# Altium project roverSwitch.PrjPcb (part 1 of 2)
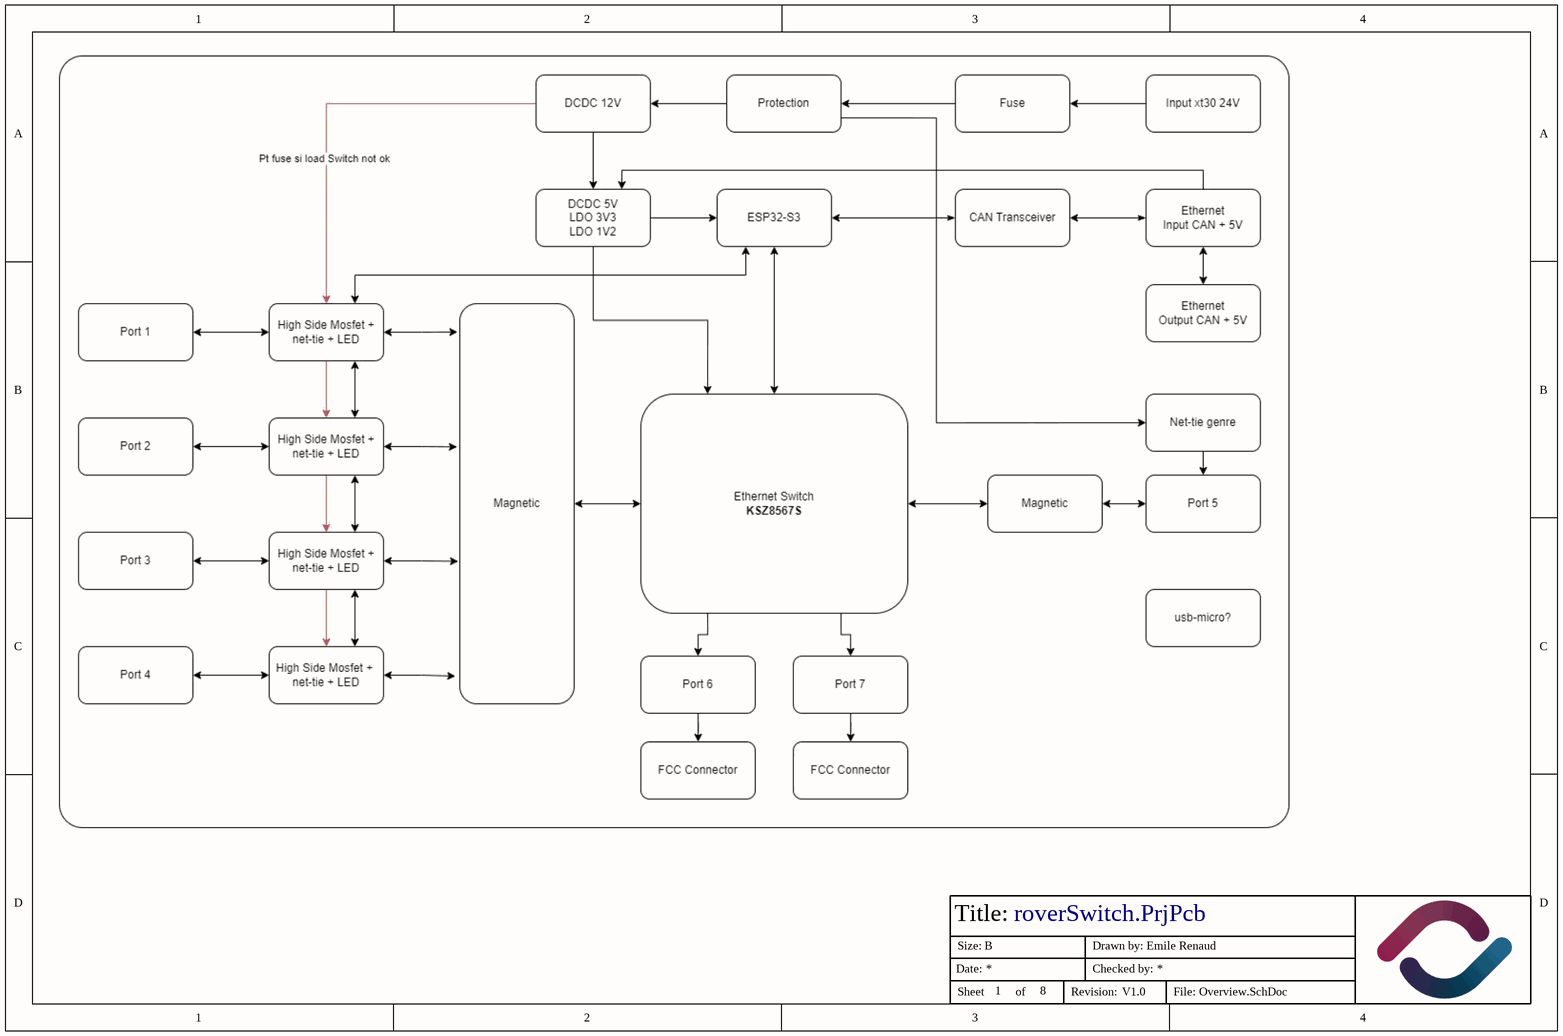
[diagram p0: Overview.SchDoc]
8 sheets, 263 parts. Net scope: flat (ports and power ports of the same name join across sheets).
Board file: roverSwitch.PcbDoc
Sheets:
  Overview.SchDoc
  Connectors_2.SchDoc
  KSZ_Switch.SchDoc
  KSZ_Switch_Control.SchDoc
  Connectors_1.SchDoc
  ESP32.SchDoc
  Power.SchDoc
  CAN-SW.SchDoc

## Sheet Overview.SchDoc
size A4; DrawnBy: Emile Renaud; Revision: V1.0; SheetNumber: 1; SheetTotal: 8

### Notes on the sheet
- Title:
- Date:
- Size:
- B
- Drawn by:
- Checked by:
- Sheet
- of
- Revision:
- File:

## Sheet Connectors_2.SchDoc
size A4; DrawnBy: Emile Renaud; Revision: V1.0; SheetNumber: 8; SheetTotal: 8
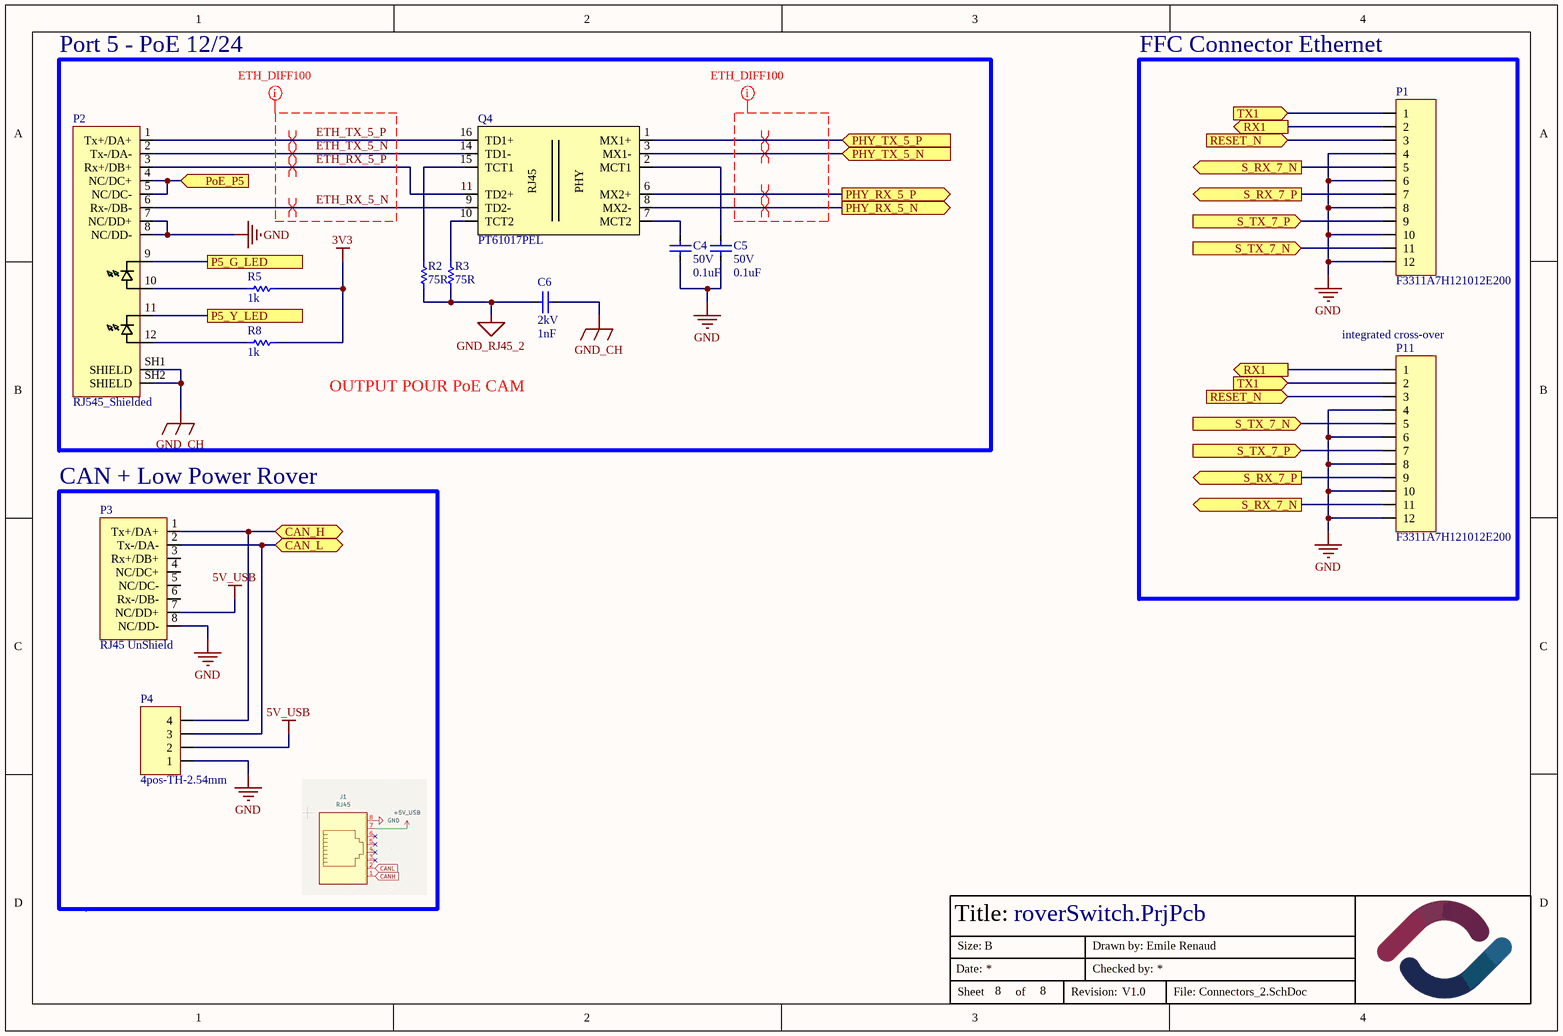
[diagram p1: Connectors_2.SchDoc]

### Parts
C4  value 0.1uF  Volt: 50V  [CAPACITOR-0603]  (hidden comment: Capacitor-0603-0.1uF-50V-X7R)
C5  value 0.1uF  Volt: 50V  [CAPACITOR-0603]  (hidden comment: Capacitor-0603-0.1uF-50V-X7R)
C6  value 1nF  Volt: 2kV  [CAPACITOR-1206]  (hidden comment: Capacitor-1206-1nF-2kV-X7R)
P1  F3311A7H121012E200  [AMPHENOL_F3311A7H121012E200]
P2  RJ545_Shielded  [ADAMTECH_MTJ-88ARX1-FSM-LG]
P3  RJ45 UnShield  [AMPHENOL_54602-908LF]
P4  4pos-TH-2.54mm  [HDR1X4]
P11  F3311A7H121012E200  [AMPHENOL_F3311A7H121012E200]
Q4  PT61017PEL  [SOIC_PT61017PEL]
R2  value 75R  [Resistor-0603]  (hidden comment: SMT resistor)
R3  value 75R  [Resistor-0603]  (hidden comment: SMT resistor)
R5  value 1k  [Resistor-0603]  (hidden comment: SMT resistor)
R8  value 1k  [Resistor-0603]  (hidden comment: SMT resistor)

### Blocks framed on the sheet
Port 5 - PoE 12/24: C4-C6 P2 Q4 R2 R3 R5 R8
FFC Connector Ethernet: P1 P11
CAN + Low Power Rover: P3 P4

### Ports
CAN_H (bidir), CAN_L (bidir), P5_G_LED, P5_Y_LED, PHY_RX_5_N (out), PHY_RX_5_P (out), PHY_TX_5_N (in), PHY_TX_5_P (in), PoE_P5 (in), RESET_N (in), RX1 (out), S_RX_7_N (out), S_RX_7_P (out), S_TX_7_N (in), S_TX_7_P (in), TX1 (in)

### Nets
3V3: R5.1 R8.1
5V_USB: P3.7(NC/DD+) P4.2
GND: C4.1 C5.1 P1.4 P1.6 P1.8 P1.10 P1.12 P2.7(NC/DD+) P2.8(NC/DD-) P3.8(NC/DD-) P4.1 P11.4 P11.6 P11.8 P11.10 P11.12
GND_CH: C6.2 P2.SH1(SHIELD) P2.SH2(SHIELD)
GND_RJ45_2: C6.1 R2.1 R3.1
CAN_H: P3.1(Tx+/DA+) P4.4 ; port CAN_H
CAN_L: P3.2(Tx-/DA-) P4.3 ; port CAN_L
ETH_RX_5_N: P2.6(Rx-/DB-) Q4.9(TD2-)
ETH_RX_5_P: P2.3(Rx+/DB+) Q4.11(TD2+)
ETH_TX_5_N: P2.2(Tx-/DA-) Q4.14(TD1-)
ETH_TX_5_P: P2.1(Tx+/DA+) Q4.16(TD1+)
P5_G_LED: P2.9 ; port P5_G_LED
P5_Y_LED: P2.11 ; port P5_Y_LED
PHY_RX_5_N: Q4.8(MX2-) ; port PHY_RX_5_N
PHY_RX_5_P: Q4.6(MX2+) ; port PHY_RX_5_P
PHY_TX_5_N: Q4.3(MX1-) ; port PHY_TX_5_N
PHY_TX_5_P: Q4.1(MX1+) ; port PHY_TX_5_P
PoE_P5: P2.4(NC/DC+) P2.5(NC/DC-) ; port PoE_P5
RESET_N: P1.3 P11.3 ; port RESET_N
RX1: P1.2 P11.1 ; port RX1
S_RX_7_N: P1.5 P11.11 ; port S_RX_7_N
S_RX_7_P: P1.7 P11.9 ; port S_RX_7_P
S_TX_7_N: P1.11 P11.5 ; port S_TX_7_N
S_TX_7_P: P1.9 P11.7 ; port S_TX_7_P
TX1: P1.1 P11.2 ; port TX1
NetC4_2: C4.2 Q4.7(MCT2)
NetC5_2: C5.2 Q4.2(MCT1)
NetP2_10: P2.10 R5.2
NetP2_12: P2.12 R8.2
NetQ4_10: Q4.10(TCT2) R3.2
NetQ4_15: Q4.15(TCT1) R2.2

Not connected (* = marked no-connect by the designer): P3 3(Rx+/DB+) 4(NC/DC+) 5(NC/DC-) 6(Rx-/DB-)

### Layout directives
net class MDI_DIFF100: (no net found under the mark), ETH_RX_5_N, ETH_RX_5_P, ETH_TX_5_N, ETH_TX_5_P
differential pair: ETH_RX_5_N, ETH_RX_5_P, ETH_TX_5_N, ETH_TX_5_P, PHY_RX_5_N, PHY_RX_5_P, PHY_TX_5_N, PHY_TX_5_P

### Notes on the sheet
- (near P11) integrated cross-over
- OUTPUT POUR PoE CAM
- Title:
- Date:
- Size:
- B
- Drawn by:
- Checked by:
- Sheet
- of
- Revision:
- File:
- (in symbol PT61017PEL) RJ45; PHY

### Library data of the parts
C4 C5 = Capacitor-0603-0.1uF-50V-X7R: Precision: X7R-10%; Package / Case: Metric 1608, EIA 0603; Mounted: Yes; Supplier 1: Digi-Key; Supplier Part Number 1: 1276-1935-2-ND; Supplier 2: Digi-Key; Supplier Part Number 2: 1276-1934-2-ND
C6 = Capacitor-1206-1nF-2kV-X7R: Precision: X7R-10%; Package / Case: Metric 3216, EIA 1206; Mounted: Yes; Supplier 1: Digi-Key; Supplier Part Number 1: 399-C1206C102KGRAC7800CT-ND; Supplier 2: Digi-Key
P1 P11 = FFC-12P-0.5MM-R/A: CONN FFC FPC 12POS 0.5MM R/A; Volt: 50V; Supplier 1: Digi-Key; Supplier Part Number 1: 609-F3311A7H121012E200CT-ND; Mounted: Yes; Package / Case: SMD
P2 = RJ545_Shielded: Jack Modular Connector 8p8c (RJ45, Ethernet) 90° Angle (Right) Shielded with LEDs; Supplier 1: Digikey; Supplier Part Number 1: 2057-MTJ-88ARX1-FSM-LG-ND; Mounted: Yes; Package / Case: SMD; Volt: N/A; HelpURL: https://app.adam-tech.com/products/download/data_sheet/203879/mtj-88arx1-fsm-lg-data-sheet.pdf
P3 = RJ545: Jack Modular Connector 8p8c (RJ45, Ethernet) 90° Angle (Right) Unshielded Cat3; Supplier 1: Digikey; Supplier Part Number 1: 609-1046-ND; Mounted: Yes; Package / Case: SMD; Volt: N/A; HelpURL: https://cdn.amphenol-cs.com/media/wysiwyg/files/drawing/c-bmj-0102.pdf
P4 = 4pos-TH-2.54mm: 4pos TH 2.54mm Header; Supplier 1: Digi-Key; Supplier Part Number 1: N/A; Mounted: Yes; Package / Case: TH; Volt: N/A
Q4 = PT61017PEL: 350µH LAN 10/100 Base-T Pulse Transformer 1CT:1CT Surface Mount; Supplier 1: Digi-Key; Supplier Part Number 1: PT61017PELCT-ND; Mounted: Yes
R2 R3 = Resistor-0603-75R: Resistor0603-75R; Precision: 1%; Watt: 0.1W; Mounted: Yes; Package / Case: Metric 1608, EIA 0603; Supplier 1: Digi-Key; Supplier Part Number 1: 311-75.0HRCT-ND
R5 R8 = Resistor-0603-1k: Resistor0603-1k; Precision: 1%; Watt: 0.1W; Mounted: Yes; Package / Case: Metric 1608, EIA 0603; Supplier 1: Digi-Key; Supplier Part Number 1: 311-1.00KHRCT-ND

## Sheet KSZ_Switch.SchDoc
size A4; DrawnBy: Emile Renaud; Revision: V1.0; SheetNumber: 5; SheetTotal: 8
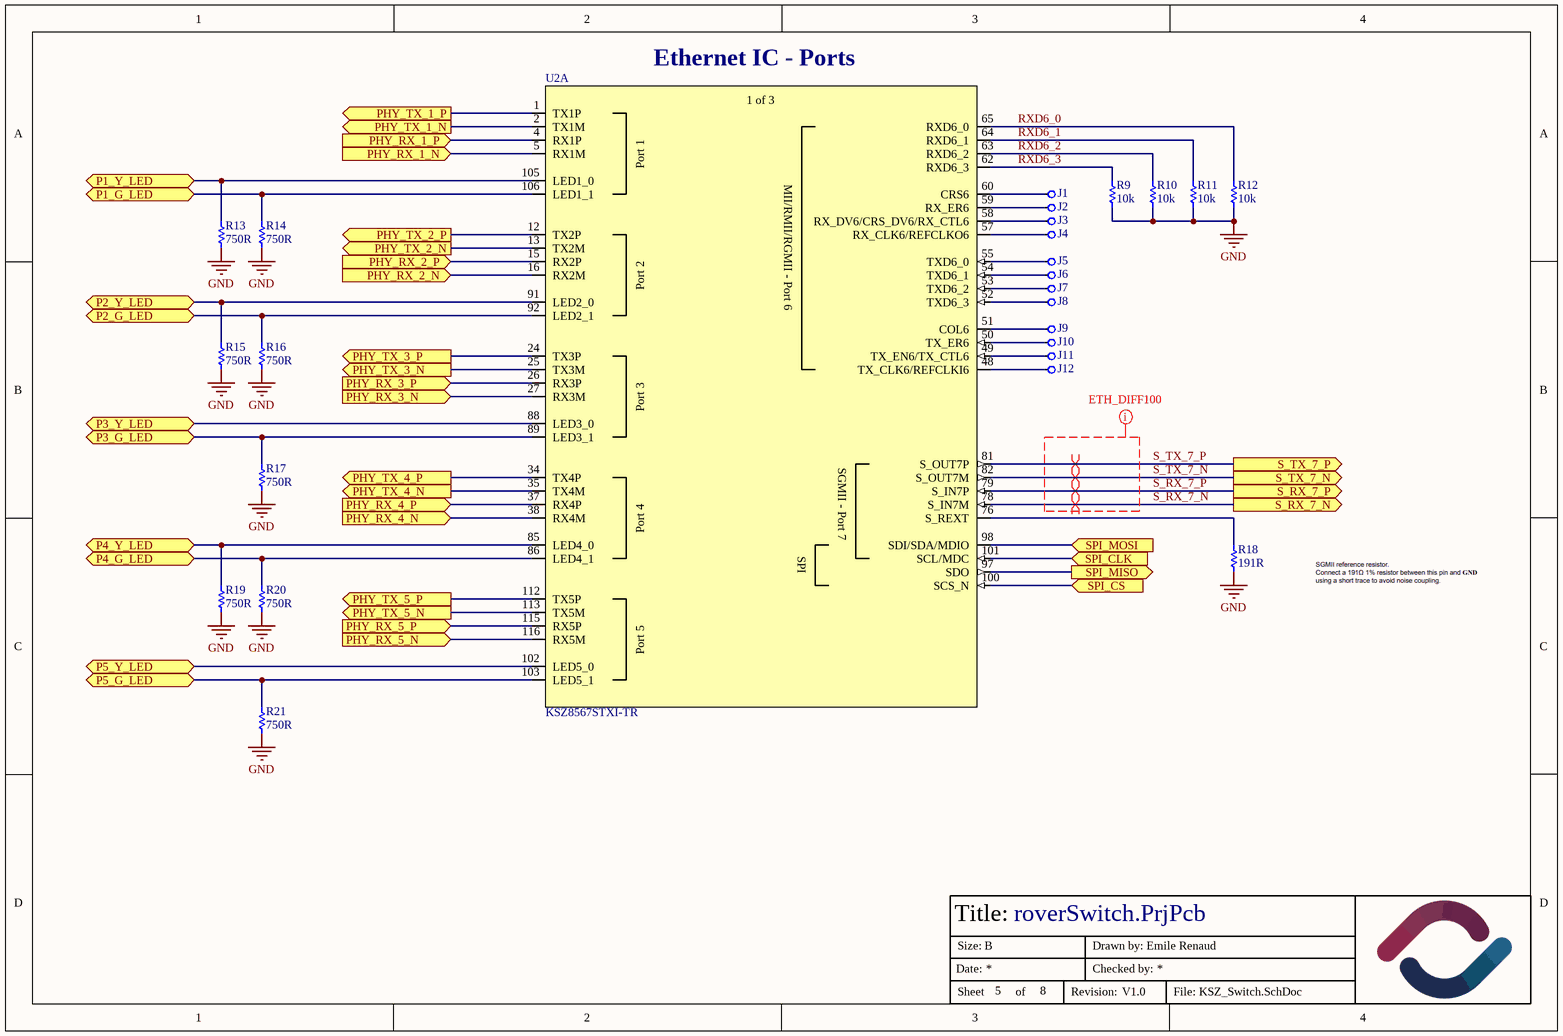
[diagram p2: KSZ_Switch.SchDoc]

### Parts
J1  hole  [PAD-0.53MM]  (value not drawn)  (no BOM)
J2  hole  [PAD-0.53MM]  (value not drawn)  (no BOM)
J3  hole  [PAD-0.53MM]  (value not drawn)  (no BOM)
J4  hole  [PAD-0.53MM]  (value not drawn)  (no BOM)
J5  hole  [PAD-0.53MM]  (value not drawn)  (no BOM)
J6  hole  [PAD-0.53MM]  (value not drawn)  (no BOM)
J7  hole  [PAD-0.53MM]  (value not drawn)  (no BOM)
J8  hole  [PAD-0.53MM]  (value not drawn)  (no BOM)
J9  hole  [PAD-0.53MM]  (value not drawn)  (no BOM)
J10  hole  [PAD-0.53MM]  (value not drawn)  (no BOM)
J11  hole  [PAD-0.53MM]  (value not drawn)  (no BOM)
J12  hole  [PAD-0.53MM]  (value not drawn)  (no BOM)
R9  value 10k  [Resistor-0603]  (hidden comment: SMT resistor)
R10  value 10k  [Resistor-0603]  (hidden comment: SMT resistor)
R11  value 10k  [Resistor-0603]  (hidden comment: SMT resistor)
R12  value 10k  [Resistor-0603]  (hidden comment: SMT resistor)
R13  value 750R  [Resistor-0603]  (hidden comment: SMT resistor)
R14  value 750R  [Resistor-0603]  (hidden comment: SMT resistor)
R15  value 750R  [Resistor-0603]  (hidden comment: SMT resistor)
R16  value 750R  [Resistor-0603]  (hidden comment: SMT resistor)
R17  value 750R  [Resistor-0603]  (hidden comment: SMT resistor)
R18  value 191R  [Resistor-0603]  (hidden comment: SMT resistor)
R19  value 750R  [Resistor-0603]  (hidden comment: SMT resistor)
R20  value 750R  [Resistor-0603]  (hidden comment: SMT resistor)
R21  value 750R  [Resistor-0603]  (hidden comment: SMT resistor)
U2  KSZ8567STXI-TR  [TQFP128_EP_6XX_MCH-M]  (part A of 3)

### Ports
P1_G_LED (bidir), P1_Y_LED (bidir), P2_G_LED (bidir), P2_Y_LED (bidir), P3_G_LED (bidir), P3_Y_LED (bidir), P4_G_LED (bidir), P4_Y_LED (bidir), P5_G_LED (bidir), P5_Y_LED (bidir), PHY_RX_1_N (in), PHY_RX_1_P (in), PHY_RX_2_N (in), PHY_RX_2_P (in), PHY_RX_3_N (in), PHY_RX_3_P (in), PHY_RX_4_N (in), PHY_RX_4_P (in), PHY_RX_5_N (in), PHY_RX_5_P (in), PHY_TX_1_N (out), PHY_TX_1_P (out), PHY_TX_2_N (out), PHY_TX_2_P (out), PHY_TX_3_N (out), PHY_TX_3_P (out), PHY_TX_4_N (out), PHY_TX_4_P (out), PHY_TX_5_N (out), PHY_TX_5_P (out), S_RX_7_N (out), S_RX_7_P (out), S_TX_7_N (out), S_TX_7_P (out), SPI_CLK (in), SPI_CS (in), SPI_MISO (out), SPI_MOSI (in)

### Nets
GND: R9.1 R10.1 R11.1 R12.1 R13.1 R14.1 R15.1 R16.1 R17.1 R18.1 R19.1 R20.1 R21.1
P1_G_LED: R14.2 U2.106(LED1_1) ; port P1_G_LED
P1_Y_LED: R13.2 U2.105(LED1_0) ; port P1_Y_LED
P2_G_LED: R16.2 U2.92(LED2_1) ; port P2_G_LED
P2_Y_LED: R15.2 U2.91(LED2_0) ; port P2_Y_LED
P3_G_LED: R17.2 U2.89(LED3_1) ; port P3_G_LED
P3_Y_LED: U2.88(LED3_0) ; port P3_Y_LED
P4_G_LED: R20.2 U2.86(LED4_1) ; port P4_G_LED
P4_Y_LED: R19.2 U2.85(LED4_0) ; port P4_Y_LED
P5_G_LED: R21.2 U2.103(LED5_1) ; port P5_G_LED
P5_Y_LED: U2.102(LED5_0) ; port P5_Y_LED
PHY_RX_1_N: U2.5(RX1M) ; port PHY_RX_1_N
PHY_RX_1_P: U2.4(RX1P) ; port PHY_RX_1_P
PHY_RX_2_N: U2.16(RX2M) ; port PHY_RX_2_N
PHY_RX_2_P: U2.15(RX2P) ; port PHY_RX_2_P
PHY_RX_3_N: U2.27(RX3M) ; port PHY_RX_3_N
PHY_RX_3_P: U2.26(RX3P) ; port PHY_RX_3_P
PHY_RX_4_N: U2.38(RX4M) ; port PHY_RX_4_N
PHY_RX_4_P: U2.37(RX4P) ; port PHY_RX_4_P
PHY_RX_5_N: U2.116(RX5M) ; port PHY_RX_5_N
PHY_RX_5_P: U2.115(RX5P) ; port PHY_RX_5_P
PHY_TX_1_N: U2.2(TX1M) ; port PHY_TX_1_N
PHY_TX_1_P: U2.1(TX1P) ; port PHY_TX_1_P
PHY_TX_2_N: U2.13(TX2M) ; port PHY_TX_2_N
PHY_TX_2_P: U2.12(TX2P) ; port PHY_TX_2_P
PHY_TX_3_N: U2.25(TX3M) ; port PHY_TX_3_N
PHY_TX_3_P: U2.24(TX3P) ; port PHY_TX_3_P
PHY_TX_4_N: U2.35(TX4M) ; port PHY_TX_4_N
PHY_TX_4_P: U2.34(TX4P) ; port PHY_TX_4_P
PHY_TX_5_N: U2.113(TX5M) ; port PHY_TX_5_N
PHY_TX_5_P: U2.112(TX5P) ; port PHY_TX_5_P
RXD6_0: R12.2 U2.65(RXD6_0)
RXD6_1: R11.2 U2.64(RXD6_1)
RXD6_2: R10.2 U2.63(RXD6_2)
RXD6_3: R9.2 U2.62(RXD6_3)
S_RX_7_N: U2.78(S_IN7M) ; port S_RX_7_N
S_RX_7_P: U2.79(S_IN7P) ; port S_RX_7_P
S_TX_7_N: U2.82(S_OUT7M) ; port S_TX_7_N
S_TX_7_P: U2.81(S_OUT7P) ; port S_TX_7_P
SPI_CLK: U2.101(SCL/MDC) ; port SPI_CLK
SPI_CS: U2.100(SCS_N) ; port SPI_CS
SPI_MISO: U2.97(SDO) ; port SPI_MISO
SPI_MOSI: U2.98(SDI/SDA/MDIO) ; port SPI_MOSI
NetJ1_1: J1.1 U2.60(CRS6)
NetJ2_1: J2.1 U2.59(RX_ER6)
NetJ3_1: J3.1 U2.58(RX_DV6/CRS_DV6/RX_CTL6)
NetJ4_1: J4.1 U2.57(RX_CLK6/REFCLKO6)
NetJ5_1: J5.1 U2.55(TXD6_0)
NetJ6_1: J6.1 U2.54(TXD6_1)
NetJ7_1: J7.1 U2.53(TXD6_2)
NetJ8_1: J8.1 U2.52(TXD6_3)
NetJ9_1: J9.1 U2.51(COL6)
NetJ10_1: J10.1 U2.50(TX_ER6)
NetJ11_1: J11.1 U2.49(TX_EN6/TX_CTL6)
NetJ12_1: J12.1 U2.48(TX_CLK6/REFCLKI6)
NetR18_2: R18.2 U2.76(S_REXT)

### Layout directives
differential pair: S_RX_7_N, S_RX_7_P, S_TX_7_N, S_TX_7_P
net class MDI_DIFF100: (no net found under the mark)

### Notes on the sheet
- (near U2) Ethernet IC - Ports
- Title:
- Date:
- Size:
- B
- Drawn by:
- Checked by:
- Sheet
- of
- Revision:
- File:
- (in symbol KSZ8567STXI-TR, part A) 1 of 3; Port 1; MII/RMII/RGMII - Port 6; Port 2; Port 3; SGMII - Port 7; Port 4; SPI; Port 5

### Library data of the parts
J1-J12 = PAD 0.53mm AWG28-Solid: PAD for 28 AWG Solid Wire; Mounted: N/A
R9-R12 = Resistor-0603-10k: Resistor0603-10k; Precision: 1%; Watt: 0.1W; Mounted: Yes; Package / Case: Metric 1608, EIA 0603; Supplier 1: Digi-Key; Supplier Part Number 1: 311-10.0KHRTR-ND
R13-R17 R19-R21 = Resistor-0603-750R: Resistor0603-750R; Precision: 1%; Watt: 0.1W; Mounted: Yes; Package / Case: Metric 1608, EIA 0603; Supplier 1: Digi-Key; Supplier Part Number 1: 311-750HRCT-ND
R18 = Resistor-0603-191R: Precision: 1%; Watt: 0.1W; Mounted: Yes; Package / Case: Metric 1608, EIA 0603; Supplier 1: Digi-Key; Supplier Part Number 1: 311-191HRCT-ND
U2 = KSZ8567STXI-TR: IC ETHERNET SWITCH 7PORT 128TQFP; Package / Case: 128TQFP; Mounted: Yes; Supplier 1: Digikey; Supplier Part Number 1: KSZ8567STXI-CT-ND; HelpURL: https://ww1.microchip.com/downloads/aemDocuments/documents/OTH/ProductDocuments/DataSheets/KSZ8567S-Data-Sheet-DS00002391C.pdf

## Sheet KSZ_Switch_Control.SchDoc
size A4; DrawnBy: Emile Renaud; Revision: V1.0; SheetNumber: 6; SheetTotal: 8
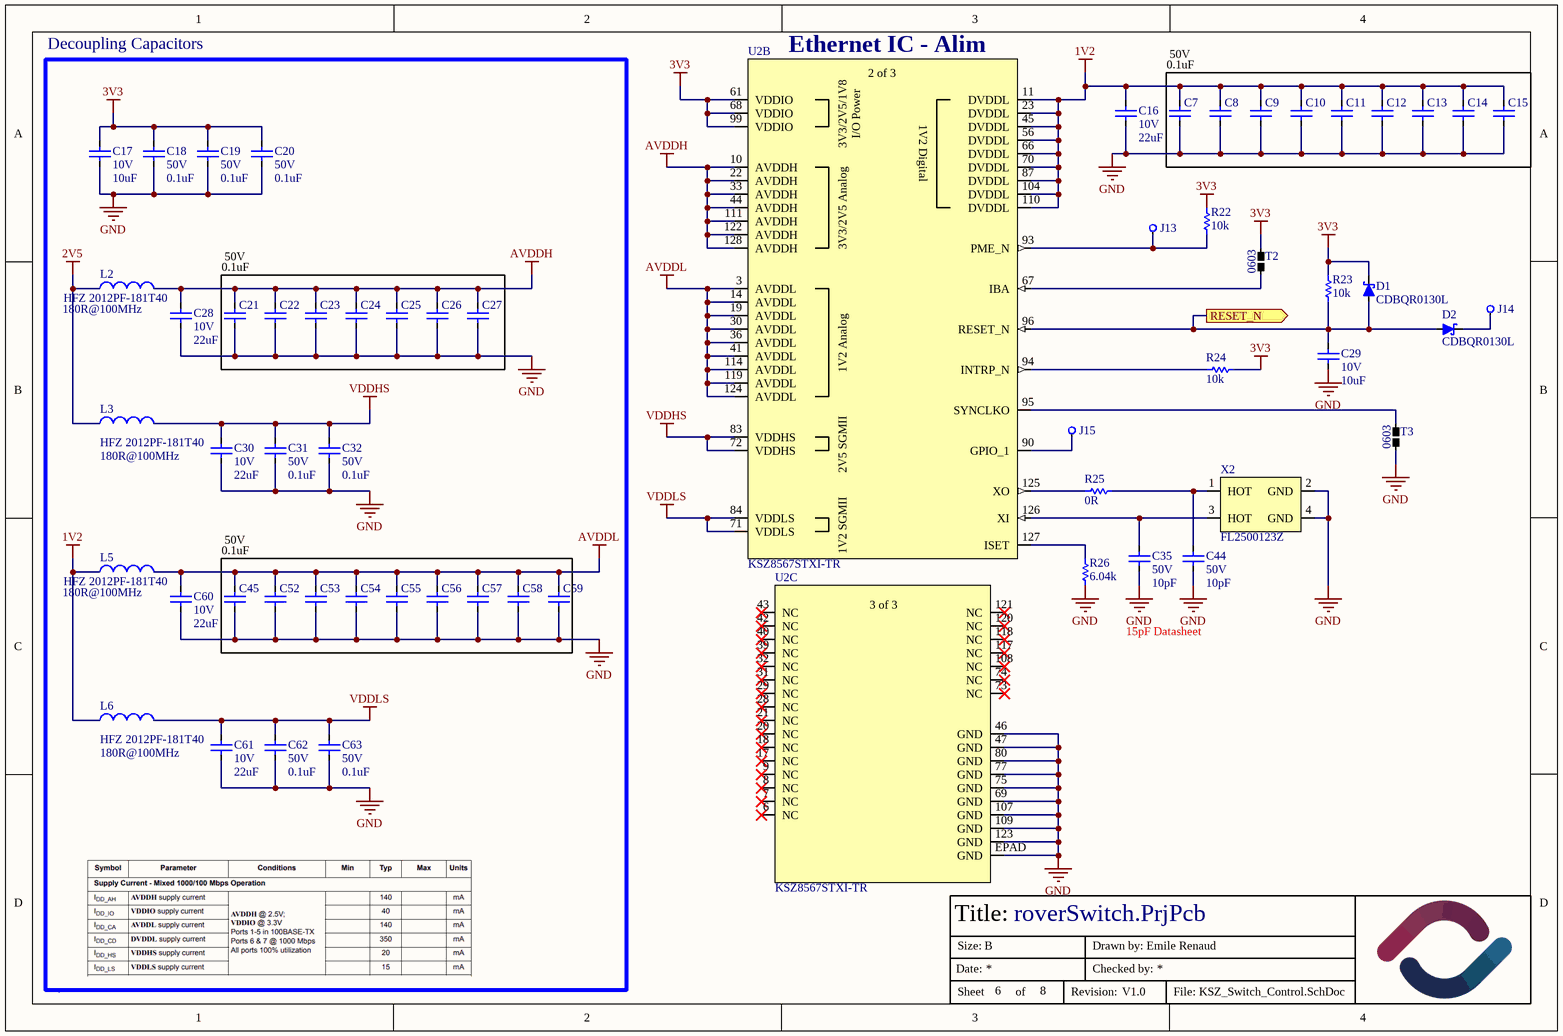
[diagram p3: KSZ_Switch_Control.SchDoc]

### Parts
C7  Capacitor-0603-0.1uF-50V-X7R  [CAPACITOR-0603]  (value not drawn)
C8  Capacitor-0603-0.1uF-50V-X7R  [CAPACITOR-0603]  (value not drawn)
C9  Capacitor-0603-0.1uF-50V-X7R  [CAPACITOR-0603]  (value not drawn)
C10  Capacitor-0603-0.1uF-50V-X7R  [CAPACITOR-0603]  (value not drawn)
C11  Capacitor-0603-0.1uF-50V-X7R  [CAPACITOR-0603]  (value not drawn)
C12  Capacitor-0603-0.1uF-50V-X7R  [CAPACITOR-0603]  (value not drawn)
C13  Capacitor-0603-0.1uF-50V-X7R  [CAPACITOR-0603]  (value not drawn)
C14  Capacitor-0603-0.1uF-50V-X7R  [CAPACITOR-0603]  (value not drawn)
C15  Capacitor-0603-0.1uF-50V-X7R  [CAPACITOR-0603]  (value not drawn)
C16  value 22uF  Volt: 10V  [CAPACITOR-0603]  (hidden comment: Capacitor-0603-22uF-10V-X5R)
C17  value 10uF  Volt: 10V  [CAPACITOR-0603]  (hidden comment: Capacitor-0603-10uF-10V-X5R)
C18  value 0.1uF  Volt: 50V  [CAPACITOR-0603]  (hidden comment: Capacitor-0603-0.1uF-50V-X7R)
C19  value 0.1uF  Volt: 50V  [CAPACITOR-0603]  (hidden comment: Capacitor-0603-0.1uF-50V-X7R)
C20  value 0.1uF  Volt: 50V  [CAPACITOR-0603]  (hidden comment: Capacitor-0603-0.1uF-50V-X7R)
C21  Capacitor-0603-0.1uF-50V-X7R  [CAPACITOR-0603]  (value not drawn)
C22  Capacitor-0603-0.1uF-50V-X7R  [CAPACITOR-0603]  (value not drawn)
C23  Capacitor-0603-0.1uF-50V-X7R  [CAPACITOR-0603]  (value not drawn)
C24  Capacitor-0603-0.1uF-50V-X7R  [CAPACITOR-0603]  (value not drawn)
C25  Capacitor-0603-0.1uF-50V-X7R  [CAPACITOR-0603]  (value not drawn)
C26  Capacitor-0603-0.1uF-50V-X7R  [CAPACITOR-0603]  (value not drawn)
C27  Capacitor-0603-0.1uF-50V-X7R  [CAPACITOR-0603]  (value not drawn)
C28  value 22uF  Volt: 10V  [CAPACITOR-0603]  (hidden comment: Capacitor-0603-22uF-10V-X5R)
C29  value 10uF  Volt: 10V  [CAPACITOR-0603]  (hidden comment: Capacitor-0603-10uF-10V-X5R)
C30  value 22uF  Volt: 10V  [CAPACITOR-0603]  (hidden comment: Capacitor-0603-22uF-10V-X5R)
C31  value 0.1uF  Volt: 50V  [CAPACITOR-0603]  (hidden comment: Capacitor-0603-0.1uF-50V-X7R)
C32  value 0.1uF  Volt: 50V  [CAPACITOR-0603]  (hidden comment: Capacitor-0603-0.1uF-50V-X7R)
C35  value 10pF  Volt: 50V  [CAPACITOR-0402]  (hidden comment: Capacitor-0402-10pF-50V-C0G)
C44  value 10pF  Volt: 50V  [CAPACITOR-0402]  (hidden comment: Capacitor-0402-10pF-50V-C0G)
C45  Capacitor-0603-0.1uF-50V-X7R  [CAPACITOR-0603]  (value not drawn)
C52  Capacitor-0603-0.1uF-50V-X7R  [CAPACITOR-0603]  (value not drawn)
C53  Capacitor-0603-0.1uF-50V-X7R  [CAPACITOR-0603]  (value not drawn)
C54  Capacitor-0603-0.1uF-50V-X7R  [CAPACITOR-0603]  (value not drawn)
C55  Capacitor-0603-0.1uF-50V-X7R  [CAPACITOR-0603]  (value not drawn)
C56  Capacitor-0603-0.1uF-50V-X7R  [CAPACITOR-0603]  (value not drawn)
C57  Capacitor-0603-0.1uF-50V-X7R  [CAPACITOR-0603]  (value not drawn)
C58  Capacitor-0603-0.1uF-50V-X7R  [CAPACITOR-0603]  (value not drawn)
C59  Capacitor-0603-0.1uF-50V-X7R  [CAPACITOR-0603]  (value not drawn)
C60  value 22uF  Volt: 10V  [CAPACITOR-0603]  (hidden comment: Capacitor-0603-22uF-10V-X5R)
C61  value 22uF  Volt: 10V  [CAPACITOR-0603]  (hidden comment: Capacitor-0603-22uF-10V-X5R)
C62  value 0.1uF  Volt: 50V  [CAPACITOR-0603]  (hidden comment: Capacitor-0603-0.1uF-50V-X7R)
C63  value 0.1uF  Volt: 50V  [CAPACITOR-0603]  (hidden comment: Capacitor-0603-0.1uF-50V-X7R)
D1  CDBQR0130L  [Diode-0402]
D2  CDBQR0130L  [Diode-0402]
J13  hole  [PAD-0.53MM]  (value not drawn)  (no BOM)
J14  hole  [PAD-0.53MM]  (value not drawn)  (no BOM)
J15  hole  [PAD-0.53MM]  (value not drawn)  (no BOM)
L2  HFZ 2012PF-181T40  value 180R@100MHz  [CAPACITOR-0805]
L3  HFZ 2012PF-181T40  value 180R@100MHz  [CAPACITOR-0805]
L5  HFZ 2012PF-181T40  value 180R@100MHz  [CAPACITOR-0805]
L6  HFZ 2012PF-181T40  value 180R@100MHz  [CAPACITOR-0805]
R22  value 10k  [Resistor-0603]  (hidden comment: SMT resistor)
R23  value 10k  [Resistor-0603]  (hidden comment: SMT resistor)
R24  value 10k  [Resistor-0603]  (hidden comment: SMT resistor)
R25  value 0R  [Resistor-0402]  (hidden comment: SMT resistor)
R26  value 6.04k  [Resistor-0603]  (hidden comment: SMT resistor)
T2  NetTie_0603  [NetTie-0603-short]  (value not drawn)
T3  NetTie_0603_Short  [NetTie-0603-short]  (value not drawn)
U2  KSZ8567STXI-TR  [TQFP128_EP_6XX_MCH-M]  (parts B,C of 3)
X2  FL2500123Z  [4-SMD]

### Blocks framed on the sheet
Decoupling Capacitors: C17-C28 C30-C32 C45 C52-C63 L2 L3 L5 L6

### Ports
RESET_N (out)

### Nets
1V2: C7.2 C8.2 C9.2 C10.2 C11.2 C12.2 C13.2 C14.2 C15.2 C16.2 L5.1 L6.1 U2.11(DVDDL) U2.23(DVDDL) U2.45(DVDDL) U2.56(DVDDL) U2.66(DVDDL) U2.70(DVDDL) U2.87(DVDDL) U2.104(DVDDL) U2.110(DVDDL)
2V5: L2.1 L3.1
3V3: C17.2 C18.2 C19.2 C20.2 D1.2(K) R22.2 R23.2 R24.2 T2.1 U2.61(VDDIO) U2.68(VDDIO) U2.99(VDDIO)
AVDDH: C21.2 C22.2 C23.2 C24.2 C25.2 C26.2 C27.2 C28.2 L2.2 U2.10(AVDDH) U2.22(AVDDH) U2.33(AVDDH) U2.44(AVDDH) U2.111(AVDDH) U2.122(AVDDH) U2.128(AVDDH)
AVDDL: C45.2 C52.2 C53.2 C54.2 C55.2 C56.2 C57.2 C58.2 C59.2 C60.2 L5.2 U2.3(AVDDL) U2.14(AVDDL) U2.19(AVDDL) U2.30(AVDDL) U2.36(AVDDL) U2.41(AVDDL) U2.114(AVDDL) U2.119(AVDDL) U2.124(AVDDL)
GND: C7.1 C8.1 C9.1 C10.1 C11.1 C12.1 C13.1 C14.1 C15.1 C16.1 C17.1 C18.1 C19.1 C20.1 C21.1 C22.1 C23.1 C24.1 C25.1 C26.1 C27.1 C28.1 C29.1 C30.1 C31.1 C32.1 C35.1 C44.1 C45.1 C52.1 C53.1 C54.1 C55.1 C56.1 C57.1 C58.1 C59.1 C60.1 C61.1 C62.1 C63.1 R26.1 T3.2 U2.46(GND) U2.47(GND) U2.69(GND) U2.75(GND) U2.77(GND) U2.80(GND) U2.107(GND) U2.109(GND) U2.123(GND) U2.EPAD(GND) X2.2(GND) X2.4(GND)
VDDHS: C30.2 C31.2 C32.2 L3.2 U2.72(VDDHS) U2.83(VDDHS)
VDDLS: C61.2 C62.2 C63.2 L6.2 U2.71(VDDLS) U2.84(VDDLS)
RESET_N: C29.2 D1.1(A) D2.1(A) R23.1 U2.96(RESET_N) ; port RESET_N
NetC35_2: C35.2 U2.126(XI) X2.3(HOT)
NetC44_2: C44.2 R25.2 X2.1(HOT)
NetD2_2: D2.2(K) J14.1
NetJ13_1: J13.1 R22.1 U2.93(PME_N)
NetJ15_1: J15.1 U2.90(GPIO_1)
NetR24_1: R24.1 U2.94(INTRP_N)
NetR25_1: R25.1 U2.125(XO)
NetR26_2: R26.2 U2.127(ISET)
NetT2_2: T2.2 U2.67(IBA)
NetT3_1: T3.1 U2.95(SYNCLKO)

Not connected (* = marked no-connect by the designer): U2 6(NC)* 7(NC)* 8(NC)* 9(NC)* 17(NC)* 18(NC)* 20(NC)* 21(NC)* 28(NC)* 29(NC)* 31(NC)* 32(NC)* 39(NC)* 40(NC)* 42(NC)* 43(NC)* 73(NC)* 74(NC)* 108(NC)* 117(NC)* 118(NC)* 120(NC)* 121(NC)*

### Notes on the sheet
- (near U2) Ethernet IC - Alim
- 0.1uF
- 50V
- 15pF Datasheet
- Title:
- Date:
- Size:
- B
- Drawn by:
- Checked by:
- Sheet
- of
- Revision:
- File:
- (in symbol KSZ8567STXI-TR, part B) 2 of 3; 3V3/2V5/1V8; I/O Power; 1V2 Digital; 3V3/2V5 Analog; 1V2 Analog; 2V5 SGMII; 1V2 SGMII
- (in symbol KSZ8567STXI-TR, part C) 3 of 3
- (in symbol NetTie_0603_Short) 0603

### Library data of the parts
C7-C15 C21-C27 C45 C52-C59 = Capacitor-0603-0.1uF-50V-X7R: Precision: X7R-10%; Volt: 50V; Value: 0.1uF; Package / Case: Metric 1608, EIA 0603; Mounted: Yes; Supplier 1: Digi-Key; Supplier Part Number 1: 1276-1935-2-ND; Supplier 2: Digi-Key; Supplier Part Number 2: 1276-1934-2-ND
C16 C28 C30 C60 C61 = Capacitor-0603-22uF-10V-X5R: Precision: 20%; Supplier 1: Digikey; Supplier Part Number 1: 1276-1274-1-ND; Mounted: Yes; Package / Case: Metric 1608 , EIA 0603
C17 C29 = Capacitor-0603-10uF-10V-X5R: 10 µF ±20% 10V Ceramic Capacitor X5R 0603 (1608 Metric); Supplier 1: Digikey; Supplier Part Number 1: 4713-GMC10X5R106M10NTCT-ND; Mounted: Yes; Package / Case: Metric 1608 , EIA 0603; Precision: 20%
C18-C20 C31 C32 C62 C63 = Capacitor-0603-0.1uF-50V-X7R: Precision: X7R-10%; Package / Case: Metric 1608, EIA 0603; Mounted: Yes; Supplier 1: Digi-Key; Supplier Part Number 1: 1276-1935-2-ND; Supplier 2: Digi-Key; Supplier Part Number 2: 1276-1934-2-ND
C35 C44 = Capacitor-0402-10pF-50V-C0G: Precision: C0G - 10%; Package / Case: 0402 (1005 Metric); Mounted: Yes; Supplier 1: Digi-Key; Supplier Part Number 1: 399-C0402C100K5GAC7867CT-ND; Supplier 2: Digi-Key; HelpURL: https://connect.kemet.com:7667/gateway/IntelliData-ComponentDocumentation/1.0/download/datasheet/C0402C100K5GACTU
D1 D2 = CDBQR0130L: Diode SCHOTTKY  30 V 100mA Surface Mount 0402/SOD-923F; Volt: 30; Supplier 1: Digi-Key; Supplier Part Number 1: 641-1271-1-ND; Mounted: Yes; Package / Case: 0402/SOD-923F
J13-J15 = PAD 0.53mm AWG28-Solid: PAD for 28 AWG Solid Wire; Mounted: N/A
L2 L3 L5 L6 = HFZ 2012PF-181T40: 180 Ohms @ 100 MHz 1 Power Line Ferrite Bead 0805 (2012 Metric) 4A 20mOhm; Supplier 1: Digi-Key; Mounted: Yes; Supplier Part Number 1: 4816-HFZ2012PF-181T40CT-ND; Package / Case: SMD; Current: 4A
R22-R24 = Resistor-0603-10k: as R9 on sheet KSZ_Switch; Mounted: Yes; Package / Case: Metric 1608, EIA 0603; Supplier 1: Digi-Key; Supplier Part Number 1: 311-10.0KHRTR-ND
R25 = Resistor-0402-0R: Precision: 1%; Watt: 1/16W; Mounted: Yes; Package / Case: Metric 1005, EIA 0402; Supplier 1: Digi-Key; Supplier Part Number 1: 311-100LRCT-ND
R26 = Resistor-0603-6.04k: Precision: 1%; Watt: 0.1W; Mounted: Yes; Package / Case: Metric 1608, EIA 0603; Supplier 1: Digi-Key; Supplier Part Number 1: 311-6.04KHRCT-ND
T2 = NetTie_0603_Short
U2 = KSZ8567STXI-TR: IC ETHERNET SWITCH 7PORT 128TQFP; Package / Case: 128TQFP; Mounted: Yes; Supplier 1: Digikey; Supplier Part Number 1: KSZ8567STXI-CT-ND; HelpURL: https://ww1.microchip.com/downloads/aemDocuments/documents/OTH/ProductDocuments/DataSheets/KSZ8567S-Data-Sheet-DS00002391C.pdf
X2 = FL2500123Z: 25 MHz ±30ppm Crystal 20pF 50 Ohms 4-SMD, No Lead; Supplier 1: Digikey; Supplier Part Number 1: FL2500123ZCT-ND; HelpURL: https://www.diodes.com/assets/Datasheets/FL.pdf

## Sheet Connectors_1.SchDoc
size A4; DrawnBy: Emile Renaud; Revision: V2.0; SheetNumber: 7; SheetTotal: 8
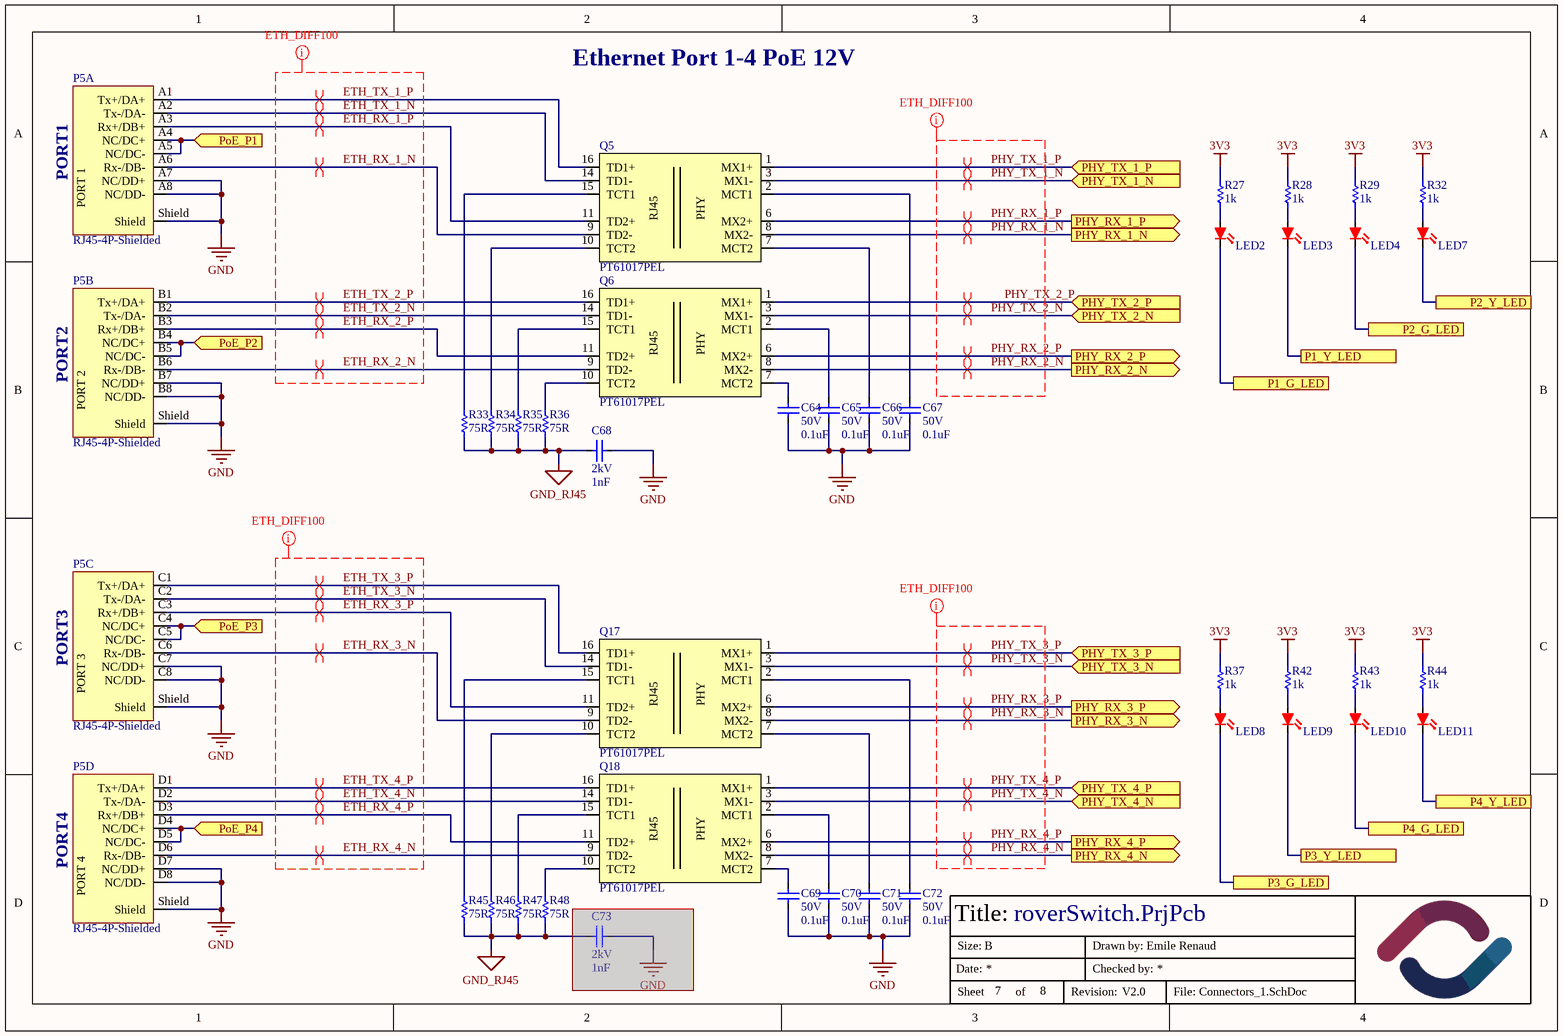
[diagram p4: Connectors_1.SchDoc]

### Parts
C64  value 0.1uF  Volt: 50V  [CAPACITOR-0603]  (hidden comment: Capacitor-0603-0.1uF-50V-X7R)
C65  value 0.1uF  Volt: 50V  [CAPACITOR-0603]  (hidden comment: Capacitor-0603-0.1uF-50V-X7R)
C66  value 0.1uF  Volt: 50V  [CAPACITOR-0603]  (hidden comment: Capacitor-0603-0.1uF-50V-X7R)
C67  value 0.1uF  Volt: 50V  [CAPACITOR-0603]  (hidden comment: Capacitor-0603-0.1uF-50V-X7R)
C68  value 1nF  Volt: 2kV  [CAPACITOR-1206]  (hidden comment: Capacitor-1206-1nF-2kV-X7R)
C69  value 0.1uF  Volt: 50V  [CAPACITOR-0603]  (hidden comment: Capacitor-0603-0.1uF-50V-X7R)
C70  value 0.1uF  Volt: 50V  [CAPACITOR-0603]  (hidden comment: Capacitor-0603-0.1uF-50V-X7R)
C71  value 0.1uF  Volt: 50V  [CAPACITOR-0603]  (hidden comment: Capacitor-0603-0.1uF-50V-X7R)
C72  value 0.1uF  Volt: 50V  [CAPACITOR-0603]  (hidden comment: Capacitor-0603-0.1uF-50V-X7R)
C73  value 1nF  Volt: 2kV  [CAPACITOR-1206]  (hidden comment: Capacitor-1206-1nF-2kV-X7R)  (masked out: inside a compile mask, not in the netlist)
LED2  B1911USD-20D000114U1930  [LED-0603-2PIN]  (value not drawn)
LED3  B1911USD-20D000114U1930  [LED-0603-2PIN]  (value not drawn)
LED4  B1911USD-20D000114U1930  [LED-0603-2PIN]  (value not drawn)
LED7  B1911USD-20D000114U1930  [LED-0603-2PIN]  (value not drawn)
LED8  B1911USD-20D000114U1930  [LED-0603-2PIN]  (value not drawn)
LED9  B1911USD-20D000114U1930  [LED-0603-2PIN]  (value not drawn)
LED10  B1911USD-20D000114U1930  [LED-0603-2PIN]  (value not drawn)
LED11  B1911USD-20D000114U1930  [LED-0603-2PIN]  (value not drawn)
P5  RJ45-4P-Shielded  [ETH_A00-432-262-450]  (parts A,B,C,D of 4)
Q5  PT61017PEL  [SOIC_PT61017PEL]
Q6  PT61017PEL  [SOIC_PT61017PEL]
Q17  PT61017PEL  [SOIC_PT61017PEL]
Q18  PT61017PEL  [SOIC_PT61017PEL]
R27  value 1k  [Resistor-0603]  (hidden comment: SMT resistor)
R28  value 1k  [Resistor-0603]  (hidden comment: SMT resistor)
R29  value 1k  [Resistor-0603]  (hidden comment: SMT resistor)
R32  value 1k  [Resistor-0603]  (hidden comment: SMT resistor)
R33  value 75R  [Resistor-0603]  (hidden comment: SMT resistor)
R34  value 75R  [Resistor-0603]  (hidden comment: SMT resistor)
R35  value 75R  [Resistor-0603]  (hidden comment: SMT resistor)
R36  value 75R  [Resistor-0603]  (hidden comment: SMT resistor)
R37  value 1k  [Resistor-0603]  (hidden comment: SMT resistor)
R42  value 1k  [Resistor-0603]  (hidden comment: SMT resistor)
R43  value 1k  [Resistor-0603]  (hidden comment: SMT resistor)
R44  value 1k  [Resistor-0603]  (hidden comment: SMT resistor)
R45  value 75R  [Resistor-0603]  (hidden comment: SMT resistor)
R46  value 75R  [Resistor-0603]  (hidden comment: SMT resistor)
R47  value 75R  [Resistor-0603]  (hidden comment: SMT resistor)
R48  value 75R  [Resistor-0603]  (hidden comment: SMT resistor)

### Ports
P1_G_LED, P1_Y_LED, P2_G_LED, P2_Y_LED, P3_G_LED, P3_Y_LED, P4_G_LED, P4_Y_LED, PHY_RX_1_N (out), PHY_RX_1_P (out), PHY_RX_2_N (out), PHY_RX_2_P (out), PHY_RX_3_N (out), PHY_RX_3_P (out), PHY_RX_4_N (out), PHY_RX_4_P (out), PHY_TX_1_N (in), PHY_TX_1_P (in), PHY_TX_2_N (in), PHY_TX_2_P (in), PHY_TX_3_N (in), PHY_TX_3_P (in), PHY_TX_4_N (in), PHY_TX_4_P (in), PoE_P1 (in), PoE_P2 (in), PoE_P3 (in), PoE_P4 (in)

### Nets
3V3: R27.2 R28.2 R29.2 R32.2 R37.2 R42.2 R43.2 R44.2
GND: C64.1 C65.1 C66.1 C67.1 C68.2 C69.1 C70.1 C71.1 C72.1 P5.A7(NC/DD+) P5.A8(NC/DD-) P5.B7(NC/DD+) P5.B8(NC/DD-) P5.C7(NC/DD+) P5.C8(NC/DD-) P5.D7(NC/DD+) P5.D8(NC/DD-) P5.Shield
GND_RJ45: C68.1 R33.1 R34.1 R35.1 R36.1 R45.1 R46.1 R47.1 R48.1
ETH_RX_1_N: P5.A6(Rx-/DB-) Q5.9(TD2-)
ETH_RX_1_P: P5.A3(Rx+/DB+) Q5.11(TD2+)
ETH_RX_2_N: P5.B6(Rx-/DB-) Q6.9(TD2-)
ETH_RX_2_P: P5.B3(Rx+/DB+) Q6.11(TD2+)
ETH_RX_3_N: P5.C6(Rx-/DB-) Q17.9(TD2-)
ETH_RX_3_P: P5.C3(Rx+/DB+) Q17.11(TD2+)
ETH_RX_4_N: P5.D6(Rx-/DB-) Q18.9(TD2-)
ETH_RX_4_P: P5.D3(Rx+/DB+) Q18.11(TD2+)
ETH_TX_1_N: P5.A2(Tx-/DA-) Q5.14(TD1-)
ETH_TX_1_P: P5.A1(Tx+/DA+) Q5.16(TD1+)
ETH_TX_2_N: P5.B2(Tx-/DA-) Q6.14(TD1-)
ETH_TX_2_P: P5.B1(Tx+/DA+) Q6.16(TD1+)
ETH_TX_3_N: P5.C2(Tx-/DA-) Q17.14(TD1-)
ETH_TX_3_P: P5.C1(Tx+/DA+) Q17.16(TD1+)
ETH_TX_4_N: P5.D2(Tx-/DA-) Q18.14(TD1-)
ETH_TX_4_P: P5.D1(Tx+/DA+) Q18.16(TD1+)
P1_G_LED: LED2.1(K) ; port P1_G_LED
P1_Y_LED: LED3.1(K) ; port P1_Y_LED
P2_G_LED: LED4.1(K) ; port P2_G_LED
P2_Y_LED: LED7.1(K) ; port P2_Y_LED
P3_G_LED: LED8.1(K) ; port P3_G_LED
P3_Y_LED: LED9.1(K) ; port P3_Y_LED
P4_G_LED: LED10.1(K) ; port P4_G_LED
P4_Y_LED: LED11.1(K) ; port P4_Y_LED
PHY_RX_1_N: Q5.8(MX2-) ; port PHY_RX_1_N
PHY_RX_1_P: Q5.6(MX2+) ; port PHY_RX_1_P
PHY_RX_2_N: Q6.8(MX2-) ; port PHY_RX_2_N
PHY_RX_2_P: Q6.6(MX2+) ; port PHY_RX_2_P
PHY_RX_3_N: Q17.8(MX2-) ; port PHY_RX_3_N
PHY_RX_3_P: Q17.6(MX2+) ; port PHY_RX_3_P
PHY_RX_4_N: Q18.8(MX2-) ; port PHY_RX_4_N
PHY_RX_4_P: Q18.6(MX2+) ; port PHY_RX_4_P
PHY_TX_1_N: Q5.3(MX1-) ; port PHY_TX_1_N
PHY_TX_1_P: Q5.1(MX1+) ; port PHY_TX_1_P
PHY_TX_2_N: Q6.3(MX1-) ; port PHY_TX_2_N
PHY_TX_2_P: Q6.1(MX1+) ; port PHY_TX_2_P
PHY_TX_3_N: Q17.3(MX1-) ; port PHY_TX_3_N
PHY_TX_3_P: Q17.1(MX1+) ; port PHY_TX_3_P
PHY_TX_4_N: Q18.3(MX1-) ; port PHY_TX_4_N
PHY_TX_4_P: Q18.1(MX1+) ; port PHY_TX_4_P
PoE_P1: P5.A4(NC/DC+) P5.A5(NC/DC-) ; port PoE_P1
PoE_P2: P5.B4(NC/DC+) P5.B5(NC/DC-) ; port PoE_P2
PoE_P3: P5.C4(NC/DC+) P5.C5(NC/DC-) ; port PoE_P3
PoE_P4: P5.D4(NC/DC+) P5.D5(NC/DC-) ; port PoE_P4
NetC64_2: C64.2 Q6.7(MCT2)
NetC65_2: C65.2 Q6.2(MCT1)
NetC66_2: C66.2 Q5.7(MCT2)
NetC67_2: C67.2 Q5.2(MCT1)
NetC69_2: C69.2 Q18.7(MCT2)
NetC70_2: C70.2 Q18.2(MCT1)
NetC71_2: C71.2 Q17.7(MCT2)
NetC72_2: C72.2 Q17.2(MCT1)
NetLED2_2: LED2.2(R) R27.1
NetLED3_2: LED3.2(R) R28.1
NetLED4_2: LED4.2(R) R29.1
NetLED7_2: LED7.2(R) R32.1
NetLED8_2: LED8.2(R) R37.1
NetLED9_2: LED9.2(R) R42.1
NetLED10_2: LED10.2(R) R43.1
NetLED11_2: LED11.2(R) R44.1
NetQ5_10: Q5.10(TCT2) R34.2
NetQ5_15: Q5.15(TCT1) R33.2
NetQ6_10: Q6.10(TCT2) R36.2
NetQ6_15: Q6.15(TCT1) R35.2
NetQ17_10: Q17.10(TCT2) R46.2
NetQ17_15: Q17.15(TCT1) R45.2
NetQ18_10: Q18.10(TCT2) R48.2
NetQ18_15: Q18.15(TCT1) R47.2

### Layout directives
net class MDI_DIFF100: ETH_RX_1_N, ETH_RX_1_P, ETH_RX_2_N, ETH_RX_2_P, ETH_RX_3_N, ETH_RX_3_P, ETH_RX_4_N, ETH_RX_4_P, ETH_TX_1_N, ETH_TX_1_P, ETH_TX_2_N, ETH_TX_2_P, ETH_TX_3_N, ETH_TX_3_P, ETH_TX_4_N, ETH_TX_4_P, PHY_RX_1_N, PHY_RX_1_P, PHY_RX_2_N, PHY_RX_2_P, PHY_RX_3_N, PHY_RX_3_P, PHY_RX_4_N, PHY_RX_4_P, PHY_TX_1_N, PHY_TX_1_P, PHY_TX_2_N, PHY_TX_2_P, PHY_TX_3_N, PHY_TX_3_P, PHY_TX_4_N, PHY_TX_4_P
differential pair: ETH_RX_1_N, ETH_RX_1_P, ETH_RX_2_N, ETH_RX_2_P, ETH_RX_3_N, ETH_RX_3_P, ETH_RX_4_N, ETH_RX_4_P, ETH_TX_1_N, ETH_TX_1_P, ETH_TX_2_N, ETH_TX_2_P, ETH_TX_3_N, ETH_TX_3_P, ETH_TX_4_N, ETH_TX_4_P, PHY_RX_1_N, PHY_RX_1_P, PHY_RX_2_N, PHY_RX_2_P, PHY_RX_3_N, PHY_RX_3_P, PHY_RX_4_N, PHY_RX_4_P, PHY_TX_1_N, PHY_TX_1_P, PHY_TX_2_N, PHY_TX_2_P, PHY_TX_3_N, PHY_TX_3_P, PHY_TX_4_N, PHY_TX_4_P

### Notes on the sheet
- Ethernet Port 1-4 PoE 12V
- PORT1
- PORT2
- PORT3
- PORT4
- Title:
- Date:
- Size:
- B
- Drawn by:
- Checked by:
- Sheet
- of
- Revision:
- File:
- (in symbol PT61017PEL) RJ45; PHY
- (in symbol RJ45-4Ports, part A) PORT 1
- (in symbol RJ45-4Ports, part B) PORT 2
- (in symbol RJ45-4Ports, part C) PORT 3
- (in symbol RJ45-4Ports, part D) PORT 4

### Library data of the parts
C64-C67 C69-C72 = Capacitor-0603-0.1uF-50V-X7R: Precision: X7R-10%; Package / Case: Metric 1608, EIA 0603; Mounted: Yes; Supplier 1: Digi-Key; Supplier Part Number 1: 1276-1935-2-ND; Supplier 2: Digi-Key; Supplier Part Number 2: 1276-1934-2-ND
C68 C73 = Capacitor-1206-1nF-2kV-X7R: Precision: X7R-10%; Package / Case: Metric 3216, EIA 1206; Mounted: Yes; Supplier 1: Digi-Key; Supplier Part Number 1: 399-C1206C102KGRAC7800CT-ND; Supplier 2: Digi-Key
LED2-LED4 LED7-LED11 = B1911USD-20D000114U1930: LED RED CLEAR 0603 SMD; Package / Case: 0603 (1608 Metric); Mounted: Yes; Supplier 1: Digi-Key; Supplier Part Number 1: 3147-B1911USD-20D000114U1930CT-ND
P5 = RJ45-4Ports: Jack Modular Connector 8p8c (RJ45, Ethernet) 90° Angle (Right) Shielded Cat5; Supplier 1: Digikey; Supplier Part Number 1: 151-1120-ND; Mounted: Yes; Package / Case: TH; Volt: N/A; HelpURL: https://mm.digikey.com/Volume0/opasdata/d220001/medias/docus/971/A00-432-262-450.pdf
Q5 Q6 Q17 Q18 = PT61017PEL: as Q4 on sheet Connectors_2; Supplier 1: Digi-Key; Supplier Part Number 1: PT61017PELCT-ND; Mounted: Yes
R27-R29 R32 R37 R42-R44 = Resistor-0603-1k: as R5 on sheet Connectors_2; Mounted: Yes; Package / Case: Metric 1608, EIA 0603; Supplier 1: Digi-Key; Supplier Part Number 1: 311-1.00KHRCT-ND
R33-R36 R45-R48 = Resistor-0603-75R: as R2 on sheet Connectors_2; Mounted: Yes; Package / Case: Metric 1608, EIA 0603; Supplier 1: Digi-Key; Supplier Part Number 1: 311-75.0HRCT-ND

## Sheet ESP32.SchDoc
size A4; DrawnBy: Emile Renaud; Revision: V1.0; SheetNumber: 3; SheetTotal: 8
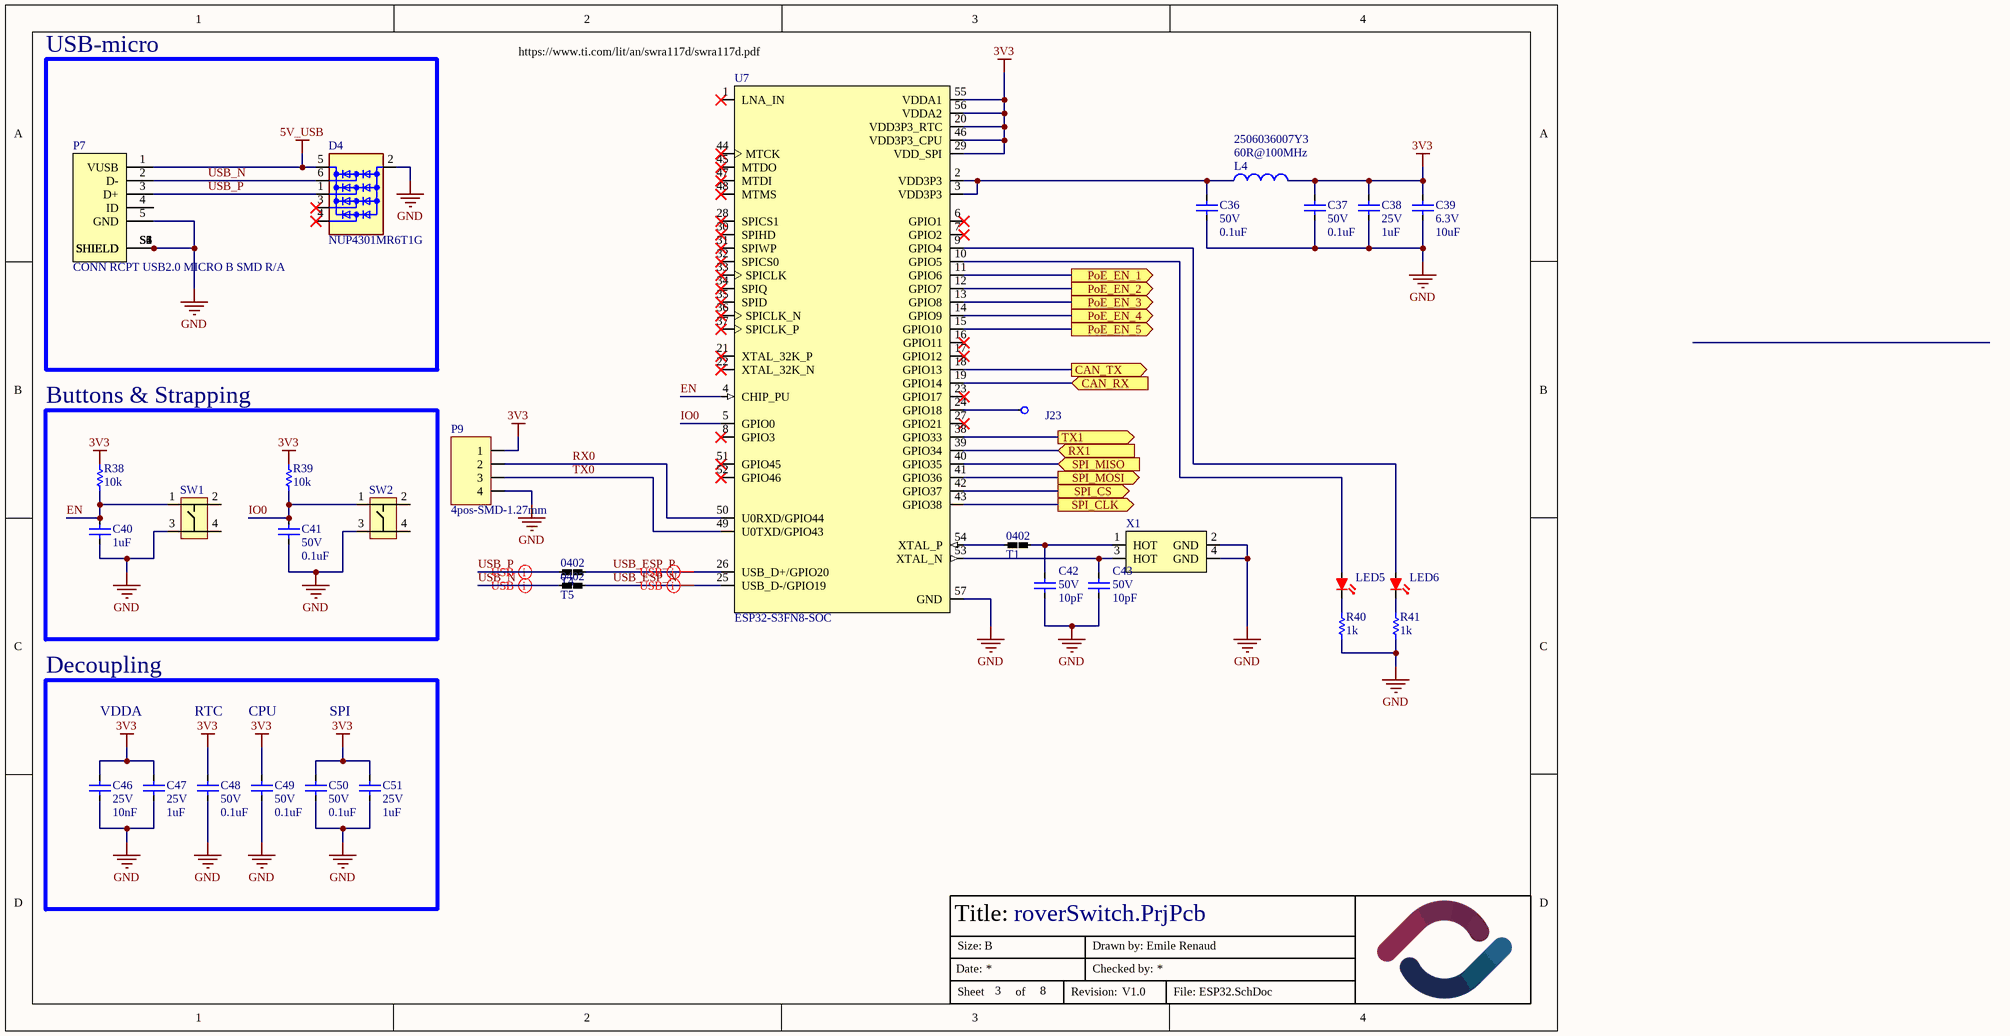
[diagram p5: ESP32.SchDoc]

### Parts
C36  value 0.1uF  Volt: 50V  [CAPACITOR-0603]  (hidden comment: Capacitor-0603-0.1uF-50V-X7R)
C37  value 0.1uF  Volt: 50V  [CAPACITOR-0603]  (hidden comment: Capacitor-0603-0.1uF-50V-X7R)
C38  value 1uF  Volt: 25V  [CAPACITOR-0603]  (hidden comment: Capacitor-0603-1uF-25V-X5R)
C39  value 10uF  Volt: 6.3V  [CAPACITOR-0603]  (hidden comment: Capacitor-0603-10uF-6.3V-X5R)
C40  value 1uF  [CAPACITOR-0603]  (hidden comment: Capacitor-0603-1uF-25V-X5R)
C41  value 0.1uF  Volt: 50V  [CAPACITOR-0603]  (hidden comment: Capacitor-0603-0.1uF-50V-X7R)
C42  value 10pF  Volt: 50V  [CAPACITOR-0402]  (hidden comment: Capacitor-0402-10pF-50V-C0G)
C43  value 10pF  Volt: 50V  [CAPACITOR-0402]  (hidden comment: Capacitor-0402-10pF-50V-C0G)
C46  value 10nF  Volt: 25V  [CAPACITOR-0603]  (hidden comment: Capacitor-0603-10nF-25V-X5R)
C47  value 1uF  Volt: 25V  [CAPACITOR-0603]  (hidden comment: Capacitor-0603-1uF-25V-X5R)
C48  value 0.1uF  Volt: 50V  [CAPACITOR-0603]  (hidden comment: Capacitor-0603-0.1uF-50V-X7R)
C49  value 0.1uF  Volt: 50V  [CAPACITOR-0603]  (hidden comment: Capacitor-0603-0.1uF-50V-X7R)
C50  value 0.1uF  Volt: 50V  [CAPACITOR-0603]  (hidden comment: Capacitor-0603-0.1uF-50V-X7R)
C51  value 1uF  Volt: 25V  [CAPACITOR-0603]  (hidden comment: Capacitor-0603-1uF-25V-X5R)
D4  NUP4301MR6T1G  [SOT-23-6]
J23  hole  [PAD-0.53MM]  (value not drawn)  (no BOM)
L4  2506036007Y3  value 60R@100MHz  [CAPACITOR-0603]
LED5  B1911USD-20D000114U1930  [LED-0603-2PIN]  (value not drawn)
LED6  B1911USD-20D000114U1930  [LED-0603-2PIN]  (value not drawn)
P7  CONN RCPT USB2.0 MICRO B SMD R/A  [FCI_10118193-0001LF]
P9  4pos-SMD-1.27mm  [HDR1X4-SMD-50mils]
R38  value 10k  [Resistor-0603]  (hidden comment: SMT resistor)
R39  value 10k  [Resistor-0603]  (hidden comment: SMT resistor)
R40  value 1k  [Resistor-0603]  (hidden comment: SMT resistor)
R41  value 1k  [Resistor-0603]  (hidden comment: SMT resistor)
SW1  PTS815 SJM 250 SMTR LFS  [SW4_PTS815 SJM 250 SMTR LFS_CNK]  (value not drawn)
SW2  PTS815 SJM 250 SMTR LFS  [SW4_PTS815 SJM 250 SMTR LFS_CNK]  (value not drawn)
T1  NetTie_0402  [NetTie-0402]  (value not drawn)
T4  NetTie_0402  [NetTie-0402]  (value not drawn)
T5  NetTie_0402  [NetTie-0402]  (value not drawn)
U7  ESP32-S3FN8-SOC  [VFQFN-56 Exposed Pad]
X1  CX2016DB40000D0FLJCC  [4-SMD]  (value not drawn)

### Blocks framed on the sheet
USB-micro: D4 P7
Buttons & Strapping: C40 C41 R38 R39 SW1 SW2
Decoupling: C46-C51

### Ports
CAN_RX (in), CAN_TX (out), PoE_EN_1 (out), PoE_EN_2 (out), PoE_EN_3 (out), PoE_EN_4 (out), PoE_EN_5 (out), RX1 (in), SPI_CLK (out), SPI_CS (out), SPI_MISO (in), SPI_MOSI (out), TX1 (out)

### Nets
3V3: C37.2 C38.2 C39.2 C46.2 C47.2 C48.2 C49.2 C50.2 C51.2 L4.2 P9.1 R38.2 R39.2 U7.20(VDD3P3_RTC) U7.29(VDD_SPI) U7.46(VDD3P3_CPU) U7.55(VDDA1) U7.56(VDDA2)
5V_USB: D4.5(VDD) P7.1(VUSB)
GND: C36.1 C37.1 C38.1 C39.1 C40.1 C41.1 C42.1 C43.1 C46.1 C47.1 C48.1 C49.1 C50.1 C51.1 D4.2(GND) P7.5(GND) P7.S1(SHIELD) P7.S2(SHIELD) P7.S3(SHIELD) P7.S4(SHIELD) P7.S5(SHIELD) P7.S6(SHIELD) P9.4 R40.1 R41.1 SW1.3 SW2.3 U7.57(GND) X1.2(GND) X1.4(GND)
CAN_RX: U7.19(GPIO14) ; port CAN_RX
CAN_TX: U7.18(GPIO13) ; port CAN_TX
EN: C40.2 R38.1 SW1.1 U7.4(CHIP_PU)
IO0: C41.2 R39.1 SW2.1 U7.5(GPIO0)
PoE_EN_1: U7.11(GPIO6) ; port PoE_EN_1
PoE_EN_2: U7.12(GPIO7) ; port PoE_EN_2
PoE_EN_3: U7.13(GPIO8) ; port PoE_EN_3
PoE_EN_4: U7.14(GPIO9) ; port PoE_EN_4
PoE_EN_5: U7.15(GPIO10) ; port PoE_EN_5
RX0: P9.2 U7.50(U0RXD/GPIO44)
RX1: U7.39(GPIO34) ; port RX1
SPI_CLK: U7.43(GPIO38) ; port SPI_CLK
SPI_CS: U7.42(GPIO37) ; port SPI_CS
SPI_MISO: U7.40(GPIO35) ; port SPI_MISO
SPI_MOSI: U7.41(GPIO36) ; port SPI_MOSI
TX0: P9.3 U7.49(U0TXD/GPIO43)
TX1: U7.38(GPIO33) ; port TX1
USB_ESP_N: T5.1 U7.25(USB_D-/GPIO19)
USB_ESP_P: T4.1 U7.26(USB_D+/GPIO20)
USB_N: D4.6(L1) P7.2(D-) T5.2
USB_P: D4.1(L2) P7.3(D+) T4.2
NetC36_2: C36.2 L4.1 U7.2(VDD3P3) U7.3(VDD3P3)
NetC42_2: C42.2 T1.1 X1.1(HOT)
NetC43_2: C43.2 U7.53(XTAL_N) X1.3(HOT)
NetJ23_1: J23.1 U7.24(GPIO18)
NetLED5_1: LED5.1(K) R40.2
NetLED5_2: LED5.2(R) U7.10(GPIO5)
NetLED6_1: LED6.1(K) R41.2
NetLED6_2: LED6.2(R) U7.9(GPIO4)
NetT1_2: T1.2 U7.54(XTAL_P)

Not connected (* = marked no-connect by the designer): D4 3(L3)* 4(L4)*; P7 4(ID); SW1 2 4; SW2 2 4; U7 1(LNA_IN)* 6(GPIO1)* 7(GPIO2)* 8(GPIO3)* 16(GPIO11)* 17(GPIO12)* 21(XTAL_32K_P)* 22(XTAL_32K_N)* 23(GPIO17)* 27(GPIO21)* 28(SPICS1)* 30(SPIHD)* 31(SPIWP)* 32(SPICS0)* 33(SPICLK)* 34(SPIQ)* 35(SPID)* 36(SPICLK_N)* 37(SPICLK_P)* 44(MTCK)* 45(MTDO)* 47(MTDI)* 48(MTMS)* 51(GPIO45)* 52(GPIO46)*

### Layout directives
differential pair; differential pair class USB: USB_ESP_N, USB_ESP_P, USB_N, USB_P

### Notes on the sheet
- (near U7) https://www.ti.com/lit/an/swra117d/swra117d.pdf
- VDDA
- RTC
- CPU
- SPI
- Title:
- Date:
- Size:
- B
- Drawn by:
- Checked by:
- Sheet
- of
- Revision:
- File:
- (in symbol NetTie_0402) 0402

### Library data of the parts
C36 C37 C41 C48-C50 = Capacitor-0603-0.1uF-50V-X7R: Precision: X7R-10%; Package / Case: Metric 1608, EIA 0603; Mounted: Yes; Supplier 1: Digi-Key; Supplier Part Number 1: 1276-1935-2-ND; Supplier 2: Digi-Key; Supplier Part Number 2: 1276-1934-2-ND
C38 C47 C51 = Capacitor-0603-1uF-25V-X5R: Precision: X5R-10%; Package / Case: Metric 1608, EIA 0603; Mounted: Yes; Supplier 1: Digi-Key; Supplier Part Number 1: 1276-1859-2-ND; Supplier 2: Digi-Key; Supplier Part Number 2: 1276-1942-2-ND
C39 = Capacitor-0603-10uF-6.3V-X5R: Capacitor-0603-10uF-6.3V-X5R, Low ESR, Low ESL; Precision: X5R-20%; Supplier 1: Arrow Electronics; Supplier Part Number 1: NMC0603X5R106M6.3TRP4KF; Mounted: Yes; Package / Case: Metric 1608 , EIA 0603
C40 = Capacitor-0603-1uF-25V-X5R: Precision: X5R-10%; Volt: 25V; Package / Case: Metric 1608, EIA 0603; Mounted: Yes; Supplier 1: Digi-Key; Supplier Part Number 1: 1276-1859-2-ND; Supplier 2: Digi-Key; Supplier 3: Digi-Key; Supplier 4: Digi-Key; Supplier Part Number 2: 1276-1942-2-ND
C42 C43 = Capacitor-0402-10pF-50V-C0G: Precision: C0G - 10%; Package / Case: 0402 (1005 Metric); Mounted: Yes; Supplier 1: Digi-Key; Supplier Part Number 1: 399-C0402C100K5GAC7867CT-ND; Supplier 2: Digi-Key; HelpURL: https://connect.kemet.com:7667/gateway/IntelliData-ComponentDocumentation/1.0/download/datasheet/C0402C100K5GACTU
C46 = Capacitor-0603-10nF-25V-X5R: 10000 pF ±10% 25V Ceramic Capacitor X5R 0603 (1608 Metric); Precision: X5R-10%; Mounted: Yes; Package / Case: Metric 1608 , EIA 0603; Supplier 1: Digikey; Supplier Part Number 1: 478-KGM15AR51E103KTCT-ND
D4 = NUP4301MR6T1G: 4CH Clamp Ipp Tvs Diode Surface Mount SOT23-6 (SC74); Volt: 70; Supplier 1: Digi-Key; Supplier Part Number 1: NUP4301MR6T1GOSTR-ND; Mounted: Yes; Package / Case: SOT23-6
J23 = PAD 0.53mm AWG28-Solid: PAD for 28 AWG Solid Wire; Mounted: N/A
L4 = 2506036007Y3: 60 Ohms @ 100 MHz 1 Signal Line Ferrite Bead 0603 (1608 Metric) 3A 40mOhm; Supplier 1: Digi-Key; Mounted: Yes; Supplier Part Number 1: 1934-1396-1-ND; Package / Case: SMD; Current: 3A
LED5 LED6 = B1911USD-20D000114U1930: LED RED CLEAR 1608 SMD; Package / Case: 0603 (1608 Metric); Mounted: Yes; Supplier 1: Digi-Key; Supplier Part Number 1: 3147-B1911USD-20D000114U1930CT-ND
P7 = USB-Micro: USB - micro B USB 2.0 Receptacle Connector 5 Position Surface Mount, Right Angle; Through Hole; Supplier 1: Digikey; Supplier Part Number 1: 609-4616-2-ND; Mounted: Yes; Package / Case: SMD; Volt: N/A
P9 = 4pos-SMD-1.27mm: 4pos SMD 1.27mm; Supplier 1: Digi-Key; Supplier Part Number 1: N/A; Mounted: Yes; Package / Case: TH; Volt: N/A
R38 R39 = Resistor0603-10k: Precision: 1%; Watt: 0.1W; Mounted: Yes; Package / Case: Metric 1608, EIA 0603; Supplier 2: Digi-Key; Supplier 4: Digi-Key; Supplier Part Number 2: RMCF0603FT10K0TR-ND; Supplier 1: Digi-Key; Supplier 3: Digi-Key; Supplier Part Number 1: 311-10.0KHRTR-ND
R40 R41 = Resistor-0603-1k: as R5 on sheet Connectors_2; Mounted: Yes; Package / Case: Metric 1608, EIA 0603; Supplier 1: Digi-Key; Supplier Part Number 1: 311-1.00KHRCT-ND
SW1 SW2 = PTS815 SJM 250 SMTR LFS: TACT 4.2 X 3.2, 2.5 MM H, 180GF,; Volt: 12V; Current: 0.05A; Supplier 1: Digi-Key; Supplier Part Number 1: CKN12215-1-ND; Mounted: Yes
U7 = ESP32-S3FN8-SOC: IC RF TxRx + MCU Bluetooth, WiFi 802.11b/g/n, Bluetooth v5.0 2.412GHz ~ 2.484GHz 56-VFQFN Exposed Pad; MF: Espressif Systems; Availability: In Stock; MP: ESP32-S3FN8; Package: 56-VFQFN Exposed Pad; DigiKey Link: https://www.digikey.ca/en/products/detail/espressif-systems/ESP32-S3FN8/15822446; HelpURL: https://www.espressif.com/sites/default/files/documentation/esp32-s3_datasheet_en.pdf; Supplier 1: Digikey; Supplier Part Number 1: 1965-ESP32-S3FN8-ND
X1 = CX2016DB40000D0FLJCC: 40 MHz ±10ppm Crystal 8pF 50 Ohms 4-SMD, No Lead; Supplier 1: Digikey; Supplier Part Number 1: 478-CX2016DB40000D0FLJCCCT-ND; Parameter 1: *

## Sheet Power.SchDoc
size A4; DrawnBy: Emile Renaud; Revision: V1.0; SheetNumber: 2; SheetTotal: 8
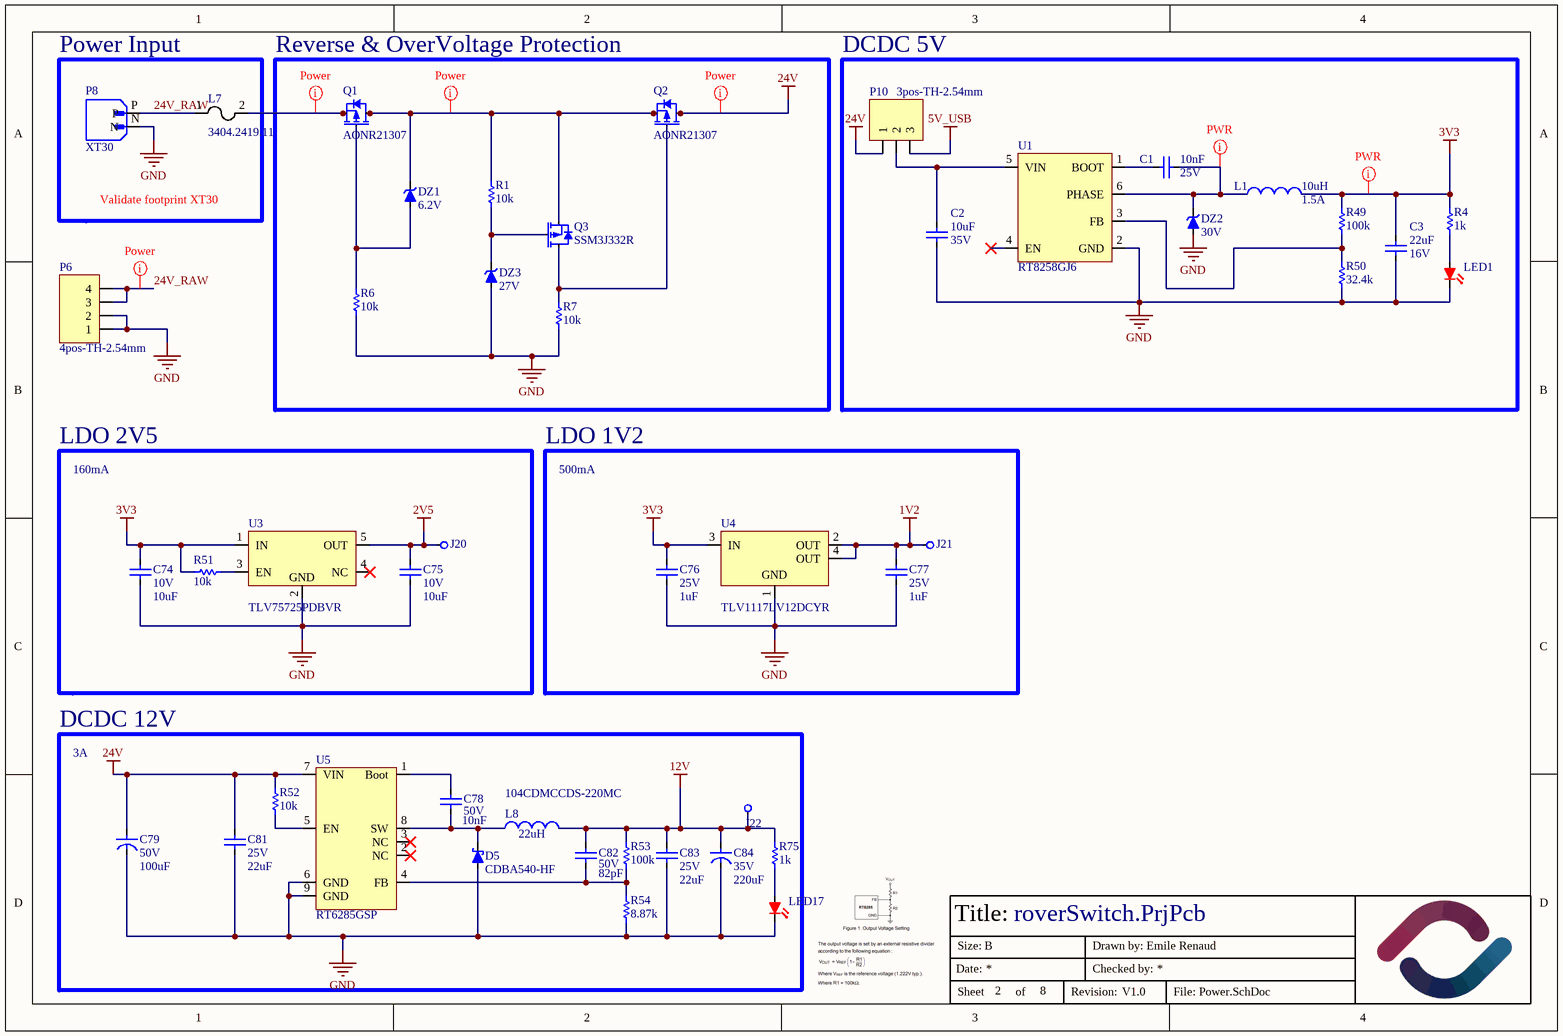
[diagram p6: Power.SchDoc]

### Parts
C1  value 10nF  Volt: 25V  [CAPACITOR-0603]  (hidden comment: Capacitor-0603-10nF-25V-X5R)
C2  value 10uF  Volt: 35V  [CAPACITOR-0805]  (hidden comment: Capacitor-0805-10uF-35V-X5R)
C3  value 22uF  Volt: 16V  [CAPACITOR-0805]  (hidden comment: Capacitor-0805-22uF-16V-X5R)
C74  value 10uF  Volt: 10V  [CAPACITOR-0603]  (hidden comment: Capacitor-0603-10uF-10V-X5R)
C75  value 10uF  Volt: 10V  [CAPACITOR-0603]  (hidden comment: Capacitor-0603-10uF-10V-X5R)
C76  value 1uF  Volt: 25V  [CAPACITOR-0603]  (hidden comment: Capacitor-0603-1uF-25V-X5R)
C77  value 1uF  Volt: 25V  [CAPACITOR-0603]  (hidden comment: Capacitor-0603-1uF-25V-X5R)
C78  value 10nF  Volt: 50V  [CAPACITOR-0603]  (hidden comment: Capacitor-0603-10nF-50V-X7R)
C79  value 100uF  Volt: 50V  [CAP_J-V_8X10P5_RUB]  (hidden comment: CAP ALUM 100UF 20% 25V SMD)
C81  value 22uF  Volt: 25V  [CAPACITOR-0805]  (hidden comment: Capacitor-0805-22uF-25V-X5R)
C82  value 82pF  Volt: 50V  [CAPACITOR-0603]  (hidden comment: Capacitor-0603-82pF-50V-C0G)
C83  value 22uF  Volt: 25V  [CAPACITOR-0805]  (hidden comment: Capacitor-0805-22uF-25V-X5R)
C84  value 220uF  Volt: 35V  [CAP_J-V_8X10P5_RUB]  (hidden comment: CAP ALUM 220UF 20% 35V SMD)
D5  CDBA540-HF  [SMA/DO-214AC]
DZ1  Volt: 6.2V  [SOD-123]  (hidden comment: BZT52C6V2-TP)
DZ2  Volt: 30V  [DO-219AD]  (hidden comment: MSS1P3L-M3/89A)
DZ3  Volt: 27V  [SOD-123F]  (hidden comment: MMSZ5254B-TP)
J20  hole  [PAD-0.53MM]  (value not drawn)  (no BOM)
J21  hole  [PAD-0.53MM]  (value not drawn)  (no BOM)
J22  hole  [PAD-0.53MM]  (value not drawn)  (no BOM)
L1  value 10uH  Current: 1.5A  [INDUCTOR_ASPI-4030S-100M]  (hidden comment: ASPI-4030S-100M-T)
L7  3404.2419.11  [2-SMD-Fuse]
L8  104CDMCCDS-220MC  value 22uH  [Inductor_22UH 5A]
LED1  B1911USD-20D000114U1930  [LED-0603-2PIN]  (value not drawn)
LED17  B1911USD-20D000114U1930  [LED-0603-2PIN]  (value not drawn)
P6  4pos-TH-2.54mm  [HDR1X4]
P8  XT30  [XT30PW_smd]
P10  3pos-TH-2.54mm  [HDR1X3]
Q1  AONR21307  [DFN8_3x3_Power]
Q2  AONR21307  [DFN8_3x3_Power]
Q3  SSM3J332R  [SOT-23-3]
R1  value 10k  [Resistor-0603]  (hidden comment: SMT resistor)
R4  value 1k  [Resistor-0603]  (hidden comment: SMT resistor)
R6  value 10k  [Resistor-0603]  (hidden comment: SMT resistor)
R7  value 10k  [Resistor-0603]  (hidden comment: SMT resistor)
R49  value 100k  [Resistor-0603]  (hidden comment: SMT resistor)
R50  value 32.4k  [Resistor-0603]  (hidden comment: SMT resistor)
R51  value 10k  [Resistor-0603]  (hidden comment: SMT resistor)
R52  value 10k  [Resistor-0603]  (hidden comment: SMT resistor)
R53  value 100k  [Resistor-0603]  (hidden comment: SMT resistor)
R54  value 8.87k  [Resistor-0603]  (hidden comment: SMT resistor)
R75  value 1k  [Resistor-0603]  (hidden comment: SMT resistor)
U1  RT8258GJ6  [SOT-23-6]
U3  TLV75725PDBVR  [SOT-23-5]
U4  TLV1117LV12DCYR  [SOT-223-3/TO-261-3S]
U5  RT6285GSP  [SOIC-8-EXPOSED-PAD]

### Blocks framed on the sheet
Power Input: L7 P8
Reverse & OverVoltage Protection: DZ1 DZ3 Q1-Q3 R1 R6 R7
DCDC 5V: C1-C3 DZ2 L1 LED1 P10 R4 R49 R50 U1
LDO 2V5: C74 C75 J20 R51 U3
LDO 1V2: C76 C77 J21 U4
DCDC 12V: C78 C79 C81-C84 D5 J22 L8 LED17 R52-R54 R75 U5

### Nets
1V2: C77.2 J21.1 U4.2(OUT) U4.4(OUT)
2V5: C75.1 J20.1 U3.5(OUT)
3V3: C3.2 C74.1 C76.2 L1.2 R4.2 R49.2 R51.2 U3.1(IN) U4.3(IN)
5V_USB: P10.3
12V: C82.2 C83.2 C84.1 J22.1 L8.2 R53.2 R75.2
24V: C79.1 C81.2 P10.1 Q2.5(D) Q2.6(D) Q2.7(D) Q2.8(D) R52.2 U5.7(VIN)
GND: C2.1 C3.1 C74.2 C75.2 C76.1 C77.1 C79.2 C81.1 C83.1 C84.2 D5.1(A) DZ2.2(A) DZ3.1(A) LED1.1(K) LED17.1(K) P6.1 P6.2 P8.N R6.1 R7.1 R50.1 R54.1 U1.2(GND) U3.2(GND) U4.1(GND) U5.6(GND) U5.9(GND)
24V_RAW: L7.1 P6.3 P6.4 P8.P
NetC1_1: C1.1 U1.1(BOOT)
NetC1_2: C1.2 DZ2.1(K) L1.1 U1.6(PHASE)
NetC2_2: C2.2 P10.2 U1.5(VIN)
NetC78_1: C78.1 D5.2(K) L8.1 U5.8(SW)
NetC78_2: C78.2 U5.1(Boot)
NetC82_1: C82.1 R53.1 R54.2 U5.4(FB)
NetDZ1_1: DZ1.1(A) Q1.4(G) R6.2
NetDZ1_2: DZ1.2(K) Q1.5(D) Q1.6(D) Q1.7(D) Q1.8(D) Q2.1(S) Q2.2(S) Q2.3(S) Q3.2(S) R1.2
NetDZ3_2: DZ3.2(K) Q3.1(G) R1.1
NetL7_2: L7.2 Q1.1(S) Q1.2(S) Q1.3(S)
NetLED1_2: LED1.2(R) R4.1
NetLED17_2: LED17.2(R) R75.1
NetQ2_4: Q2.4(G) Q3.3(D) R7.2
NetR49_1: R49.1 R50.2 U1.3(FB)
NetR51_1: R51.1 U3.3(EN)
NetR52_1: R52.1 U5.5(EN)

Not connected (* = marked no-connect by the designer): U1 4(EN)*; U3 4(NC)*; U5 2(NC)* 3(NC)*

### Layout directives
net class Power: 3V3, 24V, 24V_RAW, NetC1_2, NetDZ1_2, NetL7_2

### Notes on the sheet
- Validate footprint XT30
- 160mA
- 500mA
- 3A
- Title:
- Date:
- Size:
- B
- Drawn by:
- Checked by:
- Sheet
- of
- Revision:
- File:

### Library data of the parts
C1 = Capacitor-0603-10nF-25V-X5R: as C46 on sheet ESP32; Mounted: Yes; Package / Case: Metric 1608 , EIA 0603; Supplier 1: Digikey; Supplier Part Number 1: 478-KGM15AR51E103KTCT-ND
C2 = Capacitor-0805-10uF-35V-X5R: Precision: X5R-10%; Package / Case: Metric 2012 , EIA 0805; Mounted: Yes; Supplier 1: Digi-Key; Supplier Part Number 1: 490-10515-1-ND; Supplier 2: Digi-Key; Supplier 3: Digi-Key; Supplier 4: Digi-Key
C3 = Capacitor-0805-22uF-16V-X5R: Precision: X5R-10%; Package / Case: Metric 2012 , EIA 0805; Mounted: Yes; Supplier 1: Digi-Key; Supplier Part Number 1: 1276-6780-1-ND; Supplier 2: Digi-Key; Supplier 3: Digi-Key; Supplier 4: Digi-Key
C74 C75 = Capacitor-0603-10uF-10V-X5R: as C17 on sheet KSZ_Switch_Control; Supplier 1: Digikey; Supplier Part Number 1: 4713-GMC10X5R106M10NTCT-ND; Mounted: Yes; Package / Case: Metric 1608 , EIA 0603; Precision: 20%
C76 C77 = Capacitor-0603-1uF-25V-X5R: Precision: X5R-10%; Package / Case: Metric 1608, EIA 0603; Mounted: Yes; Supplier 1: Digi-Key; Supplier Part Number 1: 1276-1859-2-ND; Supplier 2: Digi-Key; Supplier Part Number 2: 1276-1942-2-ND
C78 = Capacitor-0603-10nF-50V-X7R: Precision: X7R-10%; Mounted: Yes; Package / Case: Metric 1608 , EIA 0603; Supplier 1: Digikey; Supplier Part Number 1: 490-4778-1-ND
C79 = Capacitor-100uF-50V-SMD: CAP ALUM 100UF 20% 50V SMD; Precision: 20%; Mounted: Yes; Supplier 1: Digi-Key; Supplier Part Number 1: 1189-1651-1-ND; Supplier 2: Digi-Key
C81 C83 = Capacitor-0805-22uF-25V-X5R: Precision: X5R-20%; Package / Case: Metric 2012 , EIA 0805; Mounted: Yes; Supplier 1: Digi-Key; Supplier Part Number 1: 490-12389-1-ND; Supplier 2: Digi-Key
C82 = Capacitor-0603-82pF-50V-C0G: Precision: C0G-5%; Package / Case: Metric 1608, EIA 0603; Mounted: Yes; Supplier 1: Digi-Key; Supplier Part Number 1: 478-KGM15ACG1H820JTCT-ND; Supplier 2: Digi-Key
C84 = Capacitor-220uF-35V-SMD: Precision: 20%; Mounted: Yes; Supplier 1: Digi-Key; Supplier Part Number 1: 1189-1651-1-ND; Supplier 2: Digi-Key
D5 = CDBA540-HF: DIODE SCHOTTKY 40V 5A SMA; Supplier 1: Digi-Key; Supplier Part Number 1: 641-1707-1-ND; Mounted: Yes; Package / Case: SMA; Volt: 40V
DZ1 = BZT52C6V2-TP: Zener Diode 6.2 V 200 mW ±6% Surface Mount SOD-123; Watt: 200mW; Grade: None; Package / Case: SOD-123; Supplier 1: Digi-Key; Supplier Part Number 1: BZT52C13-TPMSCT-ND; Mounted: Yes; Precision: 6%
DZ2 = MSS1P3L-M3/89A: Diode 30 V 1A Surface Mount MicroSMP (DO-219AD); Grade: None; Package / Case: DO-214AC, SMA; Supplier 1: Digi-Key; Supplier Part Number 1: MSS1P3L-M3/89AGICT-ND; Mounted: Yes
DZ3 = MMSZ5254B-TP: DIODE ZENER 27V 500MW SOD123; Watt: 0.5W; Precision: 5%; Grade: None; Package / Case: SOD-123; Supplier 1: Digi-Key; Supplier Part Number 1: MMSZ5254B-TPMSCT-ND; Mounted: Yes
J20-J22 = PAD 0.53mm AWG28-Solid: PAD for 28 AWG Solid Wire; Mounted: N/A
L1 = ASPI-4030S-100M-T: 10 µH Shielded Drum Core, Wirewound Inductor 1.5 A 100mOhm Nonstandard; Precision: 20%; Supplier 1: Digi-Key; Mounted: Yes; Supplier Part Number 1: 535-12314-2-ND; Package / Case: SMD
L7 = 3404.2419.11: 2 A 277 V AC 250 V DC Fuse Board Mount (Cartridge Style Excluded) Requires Holder, Surface Mount 2-SMD, Square End Block with Clip; Current: 2A; Supplier 1: Digi-Key; Mounted: Yes; Supplier Part Number 1: 486-2091-ND; Package / Case: SMD
L8 = 104CDMCCDS-220MC: FIXED IND 22UH 5A 66 MOHM SMD; Precision: 20%; Supplier 1: Digi-Key; Mounted: Yes; Supplier Part Number 1: 308-2498-1-ND; Package / Case: SMD; Current: 5A
LED1 LED17 = B1911USD-20D000114U1930: LED RED CLEAR 1608 SMD; Package / Case: 0603 (1608 Metric); Mounted: Yes; Supplier 1: Digi-Key; Supplier Part Number 1: 3147-B1911USD-20D000114U1930CT-ND
P6 = 4pos-TH-2.54mm: 4pos TH 2.54mm Header; Supplier 1: Digi-Key; Supplier Part Number 1: N/A; Mounted: Yes; Package / Case: TH; Volt: N/A
P8 = XT30_pcb: Supplier 1: Digi-Key; Mounted: Yes; Package / Case: TH; Volt: N/A
P10 = 3pos-TH-2.54mm: 3pos TH 2.54mm Header; Supplier 1: Digi-Key; Supplier Part Number 1: N/A; Mounted: Yes; Package / Case: TH; Volt: N/A
Q1 Q2 = AONR21307: MOSFET P-CH 30V 24A 8DFN; Supplier 1: Digi-Key; Supplier Part Number 1: 785-1796-2-ND; Volt: 30V; Package / Case: 8-DFN-EP (3x3); Mounted: Yes; Current: 24A
Q3 = SSM3J332R: P-Channel 30 V 6A (Ta) 1W (Ta) Surface Mount SOT-23F; Volt: 30V; Supplier 1: Digi-Key; Supplier Part Number 1: SSM3J332RLFCT-ND; Package / Case: SOT-523; Mounted: Yes; Current: 6A
R1 R6 R7 R51 = Resistor0603-10k: Precision: 1%; Watt: 0.1W; Mounted: Yes; Package / Case: Metric 1608, EIA 0603; Supplier 2: Digi-Key; Supplier 4: Digi-Key; Supplier Part Number 2: RMCF0603FT10K0TR-ND; Supplier 1: Digi-Key; Supplier 3: Digi-Key; Supplier Part Number 1: 311-10.0KHRTR-ND
R4 R75 = Resistor-0603-1k: as R5 on sheet Connectors_2; Mounted: Yes; Package / Case: Metric 1608, EIA 0603; Supplier 1: Digi-Key; Supplier Part Number 1: 311-1.00KHRCT-ND
R49 R53 = Resistor-0603-100k: Resistor0603-100k; Precision: 1%; Watt: 0.1W; Mounted: Yes; Package / Case: Metric 1608, EIA 0603; Supplier 1: Digi-Key; Supplier Part Number 1: 311-100KHRCT-ND
R50 = Resistor-0603-32.4k: Resistor0603-32.4k; Precision: 1%; Watt: 0.1W; Mounted: Yes; Package / Case: Metric 1608, EIA 0603; Supplier 1: Digi-Key; Supplier Part Number 1: 311-32.4KHRCT-ND
R52 = Resistor-0603-10k: as R9 on sheet KSZ_Switch; Mounted: Yes; Package / Case: Metric 1608, EIA 0603; Supplier 1: Digi-Key; Supplier Part Number 1: 311-10.0KHRTR-ND
R54 = Resistor-0603-8.87k: Resistor0603-8.87k; Precision: 1%; Watt: 0.1W; Mounted: Yes; Package / Case: Metric 1608, EIA 0603; Supplier 1: Digi-Key; Supplier Part Number 1: 311-8.87KHRCT-ND
U1 = REG_SWR_RT8258GJ6: Switching Regulator/Controller; Manufacturer: Richtek; Supplier: Mouser; Supplier Part Number: 835-RT8258GJ6; Manufacturer Part Number: RT8258GJ6; RoHS: Yes; Category: Voltage Regulators - Switching; Stock: 6840; Pricing: 1=0,64, 10=0,566, 50=0,566, 100=0,434, 1000=0,274, 10000=0,223 (USD); ComponentLink1URL: https://datasheet.ciiva.com:443/pdfs/VipMasterIC/IC/RHTK/RHTKS00677/RHTKS00677-1.pdf?src-supplier=IHS+Markit; ComponentLink1Description: https://datasheet.ciiva.com:443/pdfs/VipMasterIC/IC/RHTK/RHTKS00677/RHTKS00677-1.pdf?src-supplier=IHS+Markit; ComponentLink2URL: https://datasheet.ciiva.com/2035/3d3futf-83fb3frfm4mju4ltaylnbkzg3d3d3f3d-2035878.pdf?src-supplier=Digikey; ComponentLink2Description: https://datasheet.ciiva.com/2035/3d3futf-83fb3frfm4mju4ltaylnbkzg3d3d3f3d-2035878.pdf?src-supplier=Digikey; ComponentLink3URL: https://datasheet.ciiva.com/22686/1720507-22686356.pdf?src-supplier=Element14; ComponentLink3Description: https://datasheet.ciiva.com/22686/1720507-22686356.pdf?src-supplier=Element14
U3 = TLV75725PDBVR: IC REG 2.5V Positive Fixed 1 Output 1A SOT-23-5; Supplier 1: Digi-Key; Supplier Part Number 1: 296-50412-1-ND; Package / Case: SOT23-5; Mounted: Yes
U4 = TLV1117LV12DCYR: IC REG 1.2V LINEAR 1A SOT223; Supplier 1: Digi-Key; Supplier Part Number 1: 296-TLV1117LV12DCYRCT-ND; Package / Case: SOT223; Mounted: Yes
U5 = RT6285GSP: 5A Buck Switching Regulator IC Positive Adjustable 1.222V 1 Output 5A 8-SOIC (0.154", 3.90mm Width) Exposed Pad; Grade: None; Supplier 1: Digi-Key; Supplier Part Number 1: 1028-RT6285GSPCT-ND; HelpURL: file:///C:/Users/Emile/Downloads/DS6285-00.pdf; Package / Case: 8-SOIC-EP; Mounted: Yes